# Altium project fMUX_MB.PrjPCB (part 2 of 6)

## Sheet Banks_7_8.SchDoc: FPGA Motherboard for Digital Multiplexed Readout, McGill U.
size B; DocumentNumber: DfMUX5; Revision: Rev0, Prototype; SheetNumber: 5; SheetTotal: 27; PageSetup: Record=PageOptions|CenterHorizontal=True|CenterVertical=True|PrintScale=1.08|XCorrection=1.00|YCorrection=1.00|PrintKind=0|BorderSize=5000000|LeftOffset=0|BottomOffset=0|Orientation=2|PaperLength=1000|PaperWidth=1000|Scale=100|PaperSource=7|PrintQuality=-4|MediaType=1|DitherType=10|PaperKind=Tabloid|PrintScaleMode=1
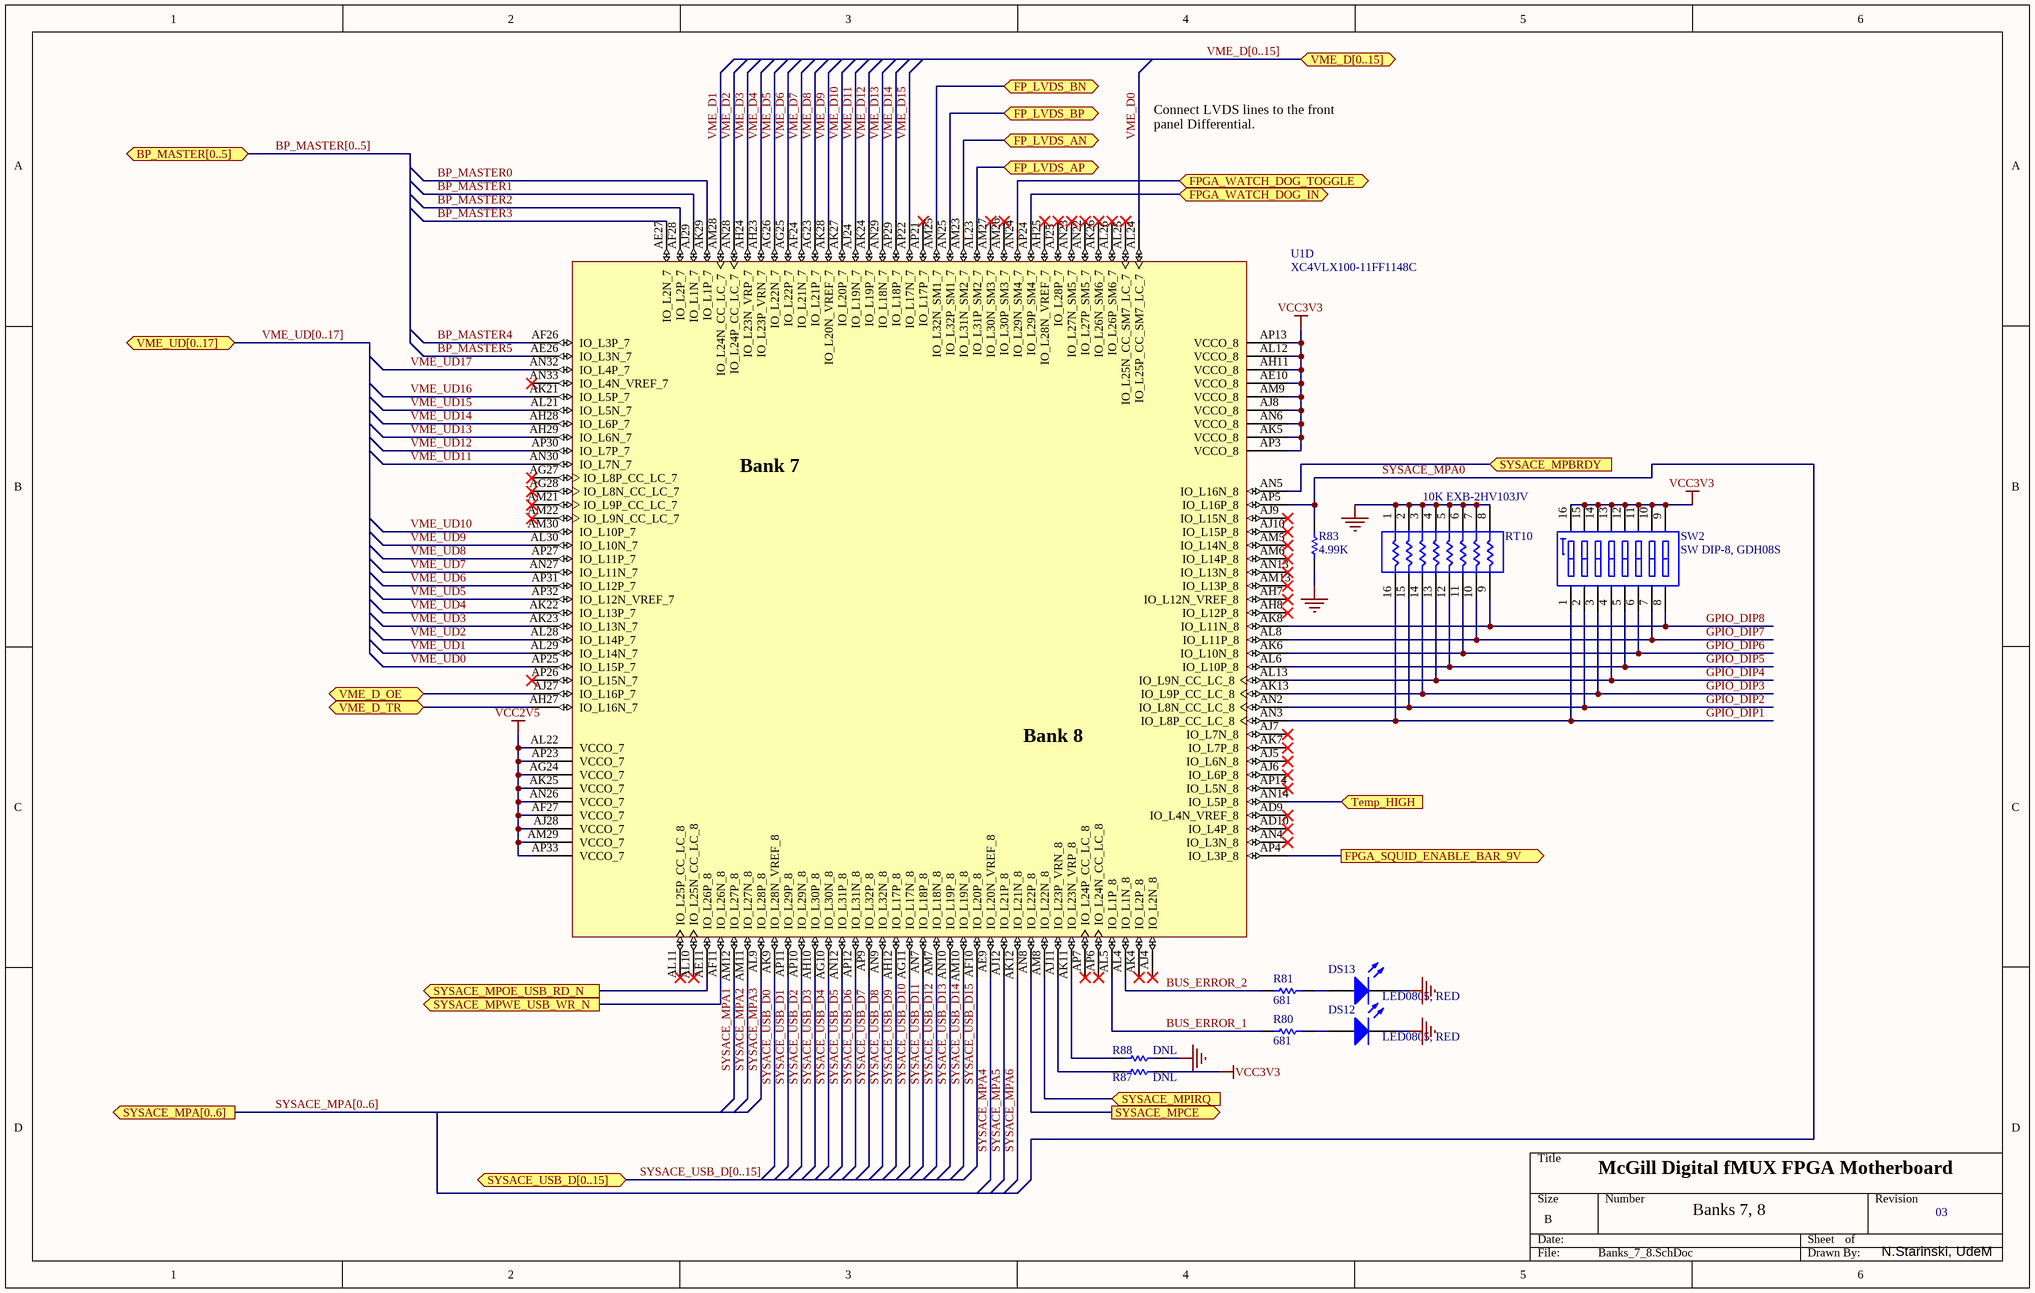
[diagram p4: Banks_7_8.SchDoc]

### Parts
DS12  LED0805, RED  [SMD _LED]
DS13  LED0805, RED  [SMD _LED]
R80  681  [CR1608-0603]
R81  681  [CR1608-0603]
R83  4.99K  [CR1608-0603]
R87  DNL  [CR1608-0603]
R88  DNL  [CR1608-0603]
RT10  10K EXB-2HV103JV  [0402_Array_2HV]
SW2  SW DIP-8, GDH08S  [DIP_SW_8WAY_SMD]
U1  XC4VLX100-11FF1148C  [FF1148]  (part D of 10)

### Ports
BP_MASTER[0..5], FP_LVDS_AN (bidir), FP_LVDS_AP (bidir), FP_LVDS_BN (bidir), FP_LVDS_BP (bidir), FPGA_SQUID_ENABLE_BAR_9V (out), FPGA_WATCH_DOG_IN (bidir), FPGA_WATCH_DOG_TOGGLE (bidir), SYSACE_MPA[0..6] (out), SYSACE_MPBRDY (in), SYSACE_MPCE (out), SYSACE_MPIRQ (in), SYSACE_MPOE_USB_RD_N (out), SYSACE_MPWE_USB_WR_N (out), SYSACE_USB_D[0..15], Temp_HIGH (in), VME_D[0..15] (bidir), VME_D_OE (bidir), VME_D_TR (bidir), VME_UD[0..17] (bidir)

### Nets
GND: DS12.2(K) DS13.2(K) R83.1 R88.2 RT10.1 RT10.2 RT10.3 RT10.4 RT10.5 RT10.6 RT10.7 RT10.8
VCC2V5: U1.AF27(VCCO_7) U1.AG24(VCCO_7) U1.AJ28(VCCO_7) U1.AK25(VCCO_7) U1.AL22(VCCO_7) U1.AM29(VCCO_7) U1.AN26(VCCO_7) U1.AP23(VCCO_7) U1.AP33(VCCO_7)  [project net Vout2]
VCC3V3: R87.2 SW2.9(B8) SW2.10(B7) SW2.11(B6) SW2.12(B5) SW2.13(B4) SW2.14(B3) SW2.15(B2) SW2.16(B1) U1.AE10(VCCO_8) U1.AH11(VCCO_8) U1.AJ8(VCCO_8) U1.AK5(VCCO_8) U1.AL12(VCCO_8) U1.AM9(VCCO_8) U1.AN6(VCCO_8) U1.AP3(VCCO_8) U1.AP13(VCCO_8)
BP_MASTER0: U1.AK29(IO_L1P_7)
BP_MASTER1: U1.AJ29(IO_L1N_7)
BP_MASTER2: U1.AF28(IO_L2P_7)
BP_MASTER3: U1.AE27(IO_L2N_7)
BP_MASTER4: U1.AF26(IO_L3P_7)
BP_MASTER5: U1.AE26(IO_L3N_7)
BUS_ERROR_1: R80.1 U1.AL5(IO_L1P_8)  [project net BUS_ERROR_1_5]
BUS_ERROR_2: R81.1 U1.AL4(IO_L1N_8)  [project net BUS_ERROR_2_5]
FDI: U1.AP24(IO_L29P_SM4_7) ; port FPGA_WATCH_DOG_IN
FDT: U1.AN24(IO_L29N_SM4_7) ; port FPGA_WATCH_DOG_TOGGLE
FP_LVDS_AN: U1.AM23(IO_L31N_SM2_7) ; port FP_LVDS_AN
FP_LVDS_AP: U1.AL23(IO_L31P_SM2_7) ; port FP_LVDS_AP
FP_LVDS_BN: U1.AM25(IO_L32N_SM1_7) ; port FP_LVDS_BN
FP_LVDS_BP: U1.AN25(IO_L32P_SM1_7) ; port FP_LVDS_BP
GPIO_DIP1: RT10.16 SW2.1(A1) U1.AN3(IO_L8P_CC_LC_8)  [project net GPIO_DIP1_5]
GPIO_DIP2: RT10.15 SW2.2(A2) U1.AN2(IO_L8N_CC_LC_8)  [project net GPIO_DIP2_5]
GPIO_DIP3: RT10.14 SW2.3(A3) U1.AK13(IO_L9P_CC_LC_8)  [project net GPIO_DIP3_5]
GPIO_DIP4: RT10.13 SW2.4(A4) U1.AL13(IO_L9N_CC_LC_8)  [project net GPIO_DIP4_5]
GPIO_DIP5: RT10.12 SW2.5(A5) U1.AL6(IO_L10P_8)  [project net GPIO_DIP5_5]
GPIO_DIP6: RT10.11 SW2.6(A6) U1.AK6(IO_L10N_8)  [project net GPIO_DIP6_5]
GPIO_DIP7: RT10.10 SW2.7(A7) U1.AL8(IO_L11P_8)  [project net GPIO_DIP7_5]
GPIO_DIP8: RT10.9 SW2.8(A8) U1.AK8(IO_L11N_8)  [project net GPIO_DIP8_5]
SQUID9V_EN: U1.AP4(IO_L3P_8) ; port FPGA_SQUID_ENABLE_BAR_9V
SYSACE_MPA0: R83.2 U1.AP5(IO_L16P_8)
SYSACE_MPA1: U1.AM12(IO_L27P_8)
SYSACE_MPA2: U1.AM11(IO_L27N_8)
SYSACE_MPA3: U1.AL9(IO_L28P_8)
SYSACE_MPA4: U1.AE9(IO_L20N_VREF_8)
SYSACE_MPA5: U1.AJ12(IO_L21P_8)
SYSACE_MPA6: U1.AK12(IO_L21N_8)
SYSACE_MPBRDY: U1.AN5(IO_L16N_8) ; port SYSACE_MPBRDY
SYSACE_MPCE: U1.AN8(IO_L22P_8) ; port SYSACE_MPCE
SYSACE_MPIRQ: U1.AM8(IO_L22N_8) ; port SYSACE_MPIRQ
SYSACE_MPOE_USB_RD_N: U1.AE11(IO_L26P_8) ; port SYSACE_MPOE_USB_RD_N
SYSACE_MPWE_USB_WR_N: U1.AF11(IO_L26N_8) ; port SYSACE_MPWE_USB_WR_N
SYSACE_USB_D0: U1.AK9(IO_L28N_VREF_8)
SYSACE_USB_D1: U1.AP11(IO_L29P_8)
SYSACE_USB_D2: U1.AP10(IO_L29N_8)
SYSACE_USB_D3: U1.AH10(IO_L30P_8)
SYSACE_USB_D4: U1.AG10(IO_L30N_8)
SYSACE_USB_D5: U1.AN12(IO_L31P_8)
SYSACE_USB_D6: U1.AP12(IO_L31N_8)
SYSACE_USB_D7: U1.AP9(IO_L32P_8)
SYSACE_USB_D8: U1.AN9(IO_L32N_8)
SYSACE_USB_D9: U1.AH12(IO_L17P_8)
SYSACE_USB_D10: U1.AG11(IO_L17N_8)
SYSACE_USB_D11: U1.AN7(IO_L18P_8)
SYSACE_USB_D12: U1.AM7(IO_L18N_8)
SYSACE_USB_D13: U1.AN10(IO_L19P_8)
SYSACE_USB_D14: U1.AM10(IO_L19N_8)
SYSACE_USB_D15: U1.AF10(IO_L20P_8)
Temp_HIGH: U1.AN14(IO_L5P_8) ; port Temp_HIGH
VME_D0: U1.AL24(IO_L25P_CC_SM7_LC_7)
VME_D1: U1.AM28(IO_L24N_CC_LC_7)
VME_D2: U1.AN28(IO_L24P_CC_LC_7)
VME_D3: U1.AH24(IO_L23N_VRP_7)
VME_D4: U1.AH23(IO_L23P_VRN_7)
VME_D5: U1.AG26(IO_L22N_7)
VME_D6: U1.AG25(IO_L22P_7)
VME_D7: U1.AF24(IO_L21N_7)
VME_D8: U1.AG23(IO_L21P_7)
VME_D9: U1.AK28(IO_L20N_VREF_7)
VME_D10: U1.AK27(IO_L20P_7)
VME_D11: U1.AJ24(IO_L19N_7)
VME_D12: U1.AK24(IO_L19P_7)
VME_D13: U1.AN29(IO_L18N_7)
VME_D14: U1.AP29(IO_L18P_7)
VME_D15: U1.AP22(IO_L17N_7)
VME_D_OE: U1.AJ27(IO_L16P_7) ; port VME_D_OE
VME_D_TR: U1.AH27(IO_L16N_7) ; port VME_D_TR
VME_UD0: U1.AP25(IO_L15P_7)
VME_UD1: U1.AL29(IO_L14N_7)
VME_UD2: U1.AL28(IO_L14P_7)
VME_UD3: U1.AK23(IO_L13N_7)
VME_UD4: U1.AK22(IO_L13P_7)
VME_UD5: U1.AP32(IO_L12N_VREF_7)
VME_UD6: U1.AP31(IO_L12P_7)
VME_UD7: U1.AN27(IO_L11N_7)
VME_UD8: U1.AP27(IO_L11P_7)
VME_UD9: U1.AL30(IO_L10N_7)
VME_UD10: U1.AM30(IO_L10P_7)
VME_UD11: U1.AN30(IO_L7N_7)
VME_UD12: U1.AP30(IO_L7P_7)
VME_UD13: U1.AH29(IO_L6N_7)
VME_UD14: U1.AH28(IO_L6P_7)
VME_UD15: U1.AL21(IO_L5N_7)
VME_UD16: U1.AK21(IO_L5P_7)
VME_UD17: U1.AN32(IO_L4P_7)
NetDS12_1: DS12.1(A) R80.2
NetDS13_1: DS13.1(A) R81.2
NetR87_1: R87.1 U1.AJ11(IO_L23P_VRN_8)
NetR88_1: R88.1 U1.AK11(IO_L23N_VRP_8)

Not connected (* = marked no-connect by the designer): U1 AD9(IO_L4N_VREF_8)* AD10(IO_L4P_8)* AG27(IO_L8P_CC_LC_7)* AG28(IO_L8N_CC_LC_7)* AH7(IO_L12N_VREF_8)* AH8(IO_L12P_8)* AH25(IO_L28N_VREF_7)* AJ4(IO_L2N_8)* AJ5(IO_L6N_8)* AJ6(IO_L6P_8)* AJ7(IO_L7N_8)* AJ9(IO_L15N_8)* AJ10(IO_L15P_8)* AJ25(IO_L28P_7)* AK4(IO_L2P_8)* AK7(IO_L7P_8)* AK26(IO_L26N_SM6_7)* AL10(IO_L25N_CC_LC_8)* AL11(IO_L25P_CC_LC_8)* AL25(IO_L25N_CC_SM7_LC_7)* AL26(IO_L26P_SM6_7)* AM5(IO_L14N_8)* AM6(IO_L14P_8)* AM13(IO_L13P_8)* AM21(IO_L9P_CC_LC_7)* AM22(IO_L9N_CC_LC_7)* AM26(IO_L30P_SM3_7)* AM27(IO_L30N_SM3_7)* AN4(IO_L3N_8)* AN13(IO_L13N_8)* AN22(IO_L27P_SM5_7)* AN23(IO_L27N_SM5_7)* AN33(IO_L4N_VREF_7)* AP6(IO_L24N_CC_LC_8)* AP7(IO_L24P_CC_LC_8)* AP14(IO_L5N_8)* AP21(IO_L17P_7)* AP26(IO_L15N_7)*

### Buses and harness runs
bus BP_MASTER[0..5] = port BP_MASTER[0..5]
bus SYSACE_MPA[0..6] = port SYSACE_MPA[0..6]
bus SYSACE_USB_D[0..15] = port SYSACE_USB_D[0..15]
bus VME_D[0..15] = port VME_D[0..15]
bus VME_UD[0..17] = port VME_UD[0..17]

### Notes on the sheet
- Connect LVDS lines to the front panel Differential.
- McGill Digital fMUX FPGA Motherboard
- Banks 7, 8
- 03
- N.Starinski, UdeM
- (in symbol XC4VLX100-11FF1148C, part D) Bank 7; Bank 8

### Library data of the parts
DS12 DS13 = LED3: LED 0805 LTST-C170CKT; Published: 8-Jun-2000; LatestRevisionDate: 17-Dec-2003; LatestRevisionNote: PCB Footprint replaced.; Publisher: Altium Limited
R80 R81 R83 = Res Semi: Resistor 0603; Published: 8-Jun-2000; LatestRevisionDate: 17-Jul-2002; LatestRevisionNote: Re-released for DXP Platform.; Publisher: Altium Limited
R87 R88 = Res Semi: Semiconductor Resistor; Published: 8-Jun-2000; LatestRevisionDate: 17-Jul-2002; LatestRevisionNote: Re-released for DXP Platform.; Publisher: Altium Limited
RT10 = Res Pack3: Isolated Resistor Network; Published: 24-Mar-1999; LatestRevisionDate: 17-Jul-2002; LatestRevisionNote: Re-released for DXP Platform.; Publisher: Altium Limited
SW2 = SW DIP-8: DIP Switch, 8 Position, SPST; Published: 24-Mar-1999; LatestRevisionDate: 17-Jul-2002; LatestRevisionNote: Re-released for DXP Platform.; Publisher: Altium Limited
U1 = XC4VLX100-11FF1148C: Xilinx Virtex-4 LX Platform FPGA, 1148-Ball FFBGA, Speed Grade 11, 768 User I/Os, Commercial Grade; PackageDocument: ver1.0, Oct-2002; Published: 13-Dec-2004; LatestRevisionDate: 4-Mar-2005; LatestRevisionNote: D_IN & CS_B pins changed from I/O to Input. DOUT_BUSY pin changed from I/O to Output.; DatasheetDocument: ver1.2, Dec-2004; PackageReference: FF1148; Publisher: Altium Limited; ComponentLink2Description: Virtex-4 Overview; ComponentLink2URL: http://www.xilinx.com/products/virtex4/overview.htm; ComponentLink3Description: Datasheet; ComponentLink3URL: http://direct.xilinx.com/bvdocs/userguides/ug075.pdf; Code_JEDEC: MS-034-AAR-1

## Sheet Banks_9_10.SchDoc: FPGA Motherboard for Digital Multiplexed Readout, McGill U.
size B; DocumentNumber: DfMUX6; Revision: Rev0, Prototype; SheetNumber: 6; SheetTotal: 27; PageSetup: Record=PageOptions|CenterHorizontal=True|CenterVertical=True|PrintScale=1.08|XCorrection=1.00|YCorrection=1.00|PrintKind=0|BorderSize=5000000|LeftOffset=0|BottomOffset=0|Orientation=2|PaperLength=1000|PaperWidth=1000|Scale=100|PaperSource=7|PrintQuality=-4|MediaType=1|DitherType=10|PaperKind=Tabloid|PrintScaleMode=1
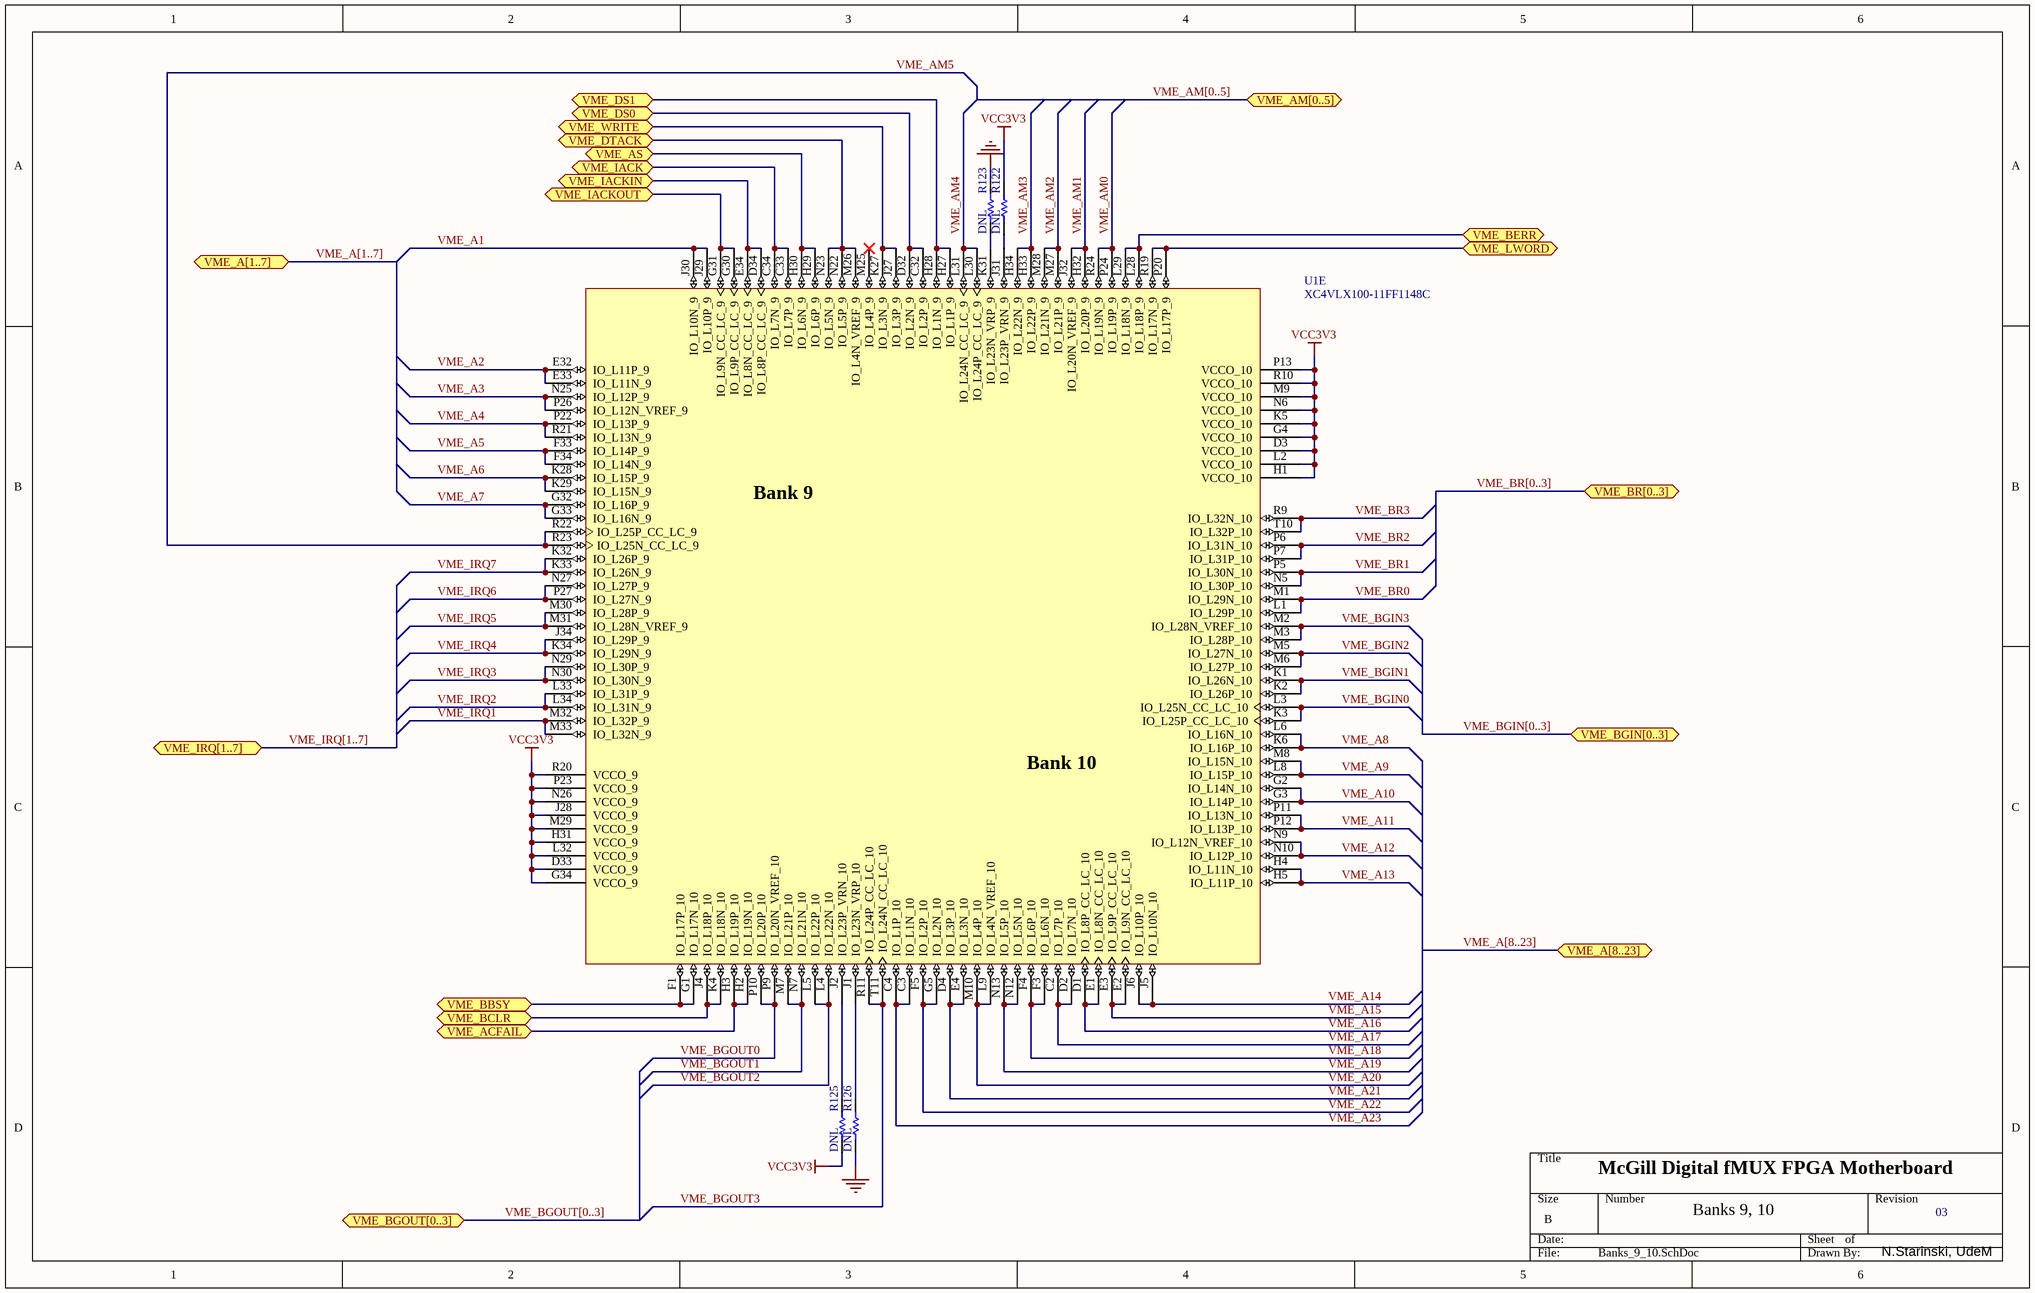
[diagram p5: Banks_9_10.SchDoc]

### Parts
R122  DNL  [CR1608-0603]
R123  DNL  [CR1608-0603]
R125  DNL  [CR1608-0603]
R126  DNL  [CR1608-0603]
U1  XC4VLX100-11FF1148C  [FF1148]  (part E of 10)

### Ports
VME_A[1..7] (bidir), VME_A[8..23] (bidir), VME_ACFAIL (bidir), VME_AM[0..5] (bidir), VME_AS (bidir), VME_BBSY (bidir), VME_BCLR (bidir), VME_BERR (bidir), VME_BGIN[0..3] (bidir), VME_BGOUT[0..3] (bidir), VME_BR[0..3] (bidir), VME_DS0 (bidir), VME_DS1 (bidir), VME_DTACK (bidir), VME_IACK (bidir), VME_IACKIN (bidir), VME_IACKOUT (bidir), VME_IRQ[1..7] (bidir), VME_LWORD (bidir), VME_WRITE (bidir)

### Nets
GND: R123.2 R126.1
VCC3V3: R122.2 R125.1 U1.D3(VCCO_10) U1.D33(VCCO_9) U1.G4(VCCO_10) U1.G34(VCCO_9) U1.H1(VCCO_10) U1.H31(VCCO_9) U1.J28(VCCO_9) U1.K5(VCCO_10) U1.L2(VCCO_10) U1.L32(VCCO_9) U1.M9(VCCO_10) U1.M29(VCCO_9) U1.N6(VCCO_10) U1.N26(VCCO_9) U1.P13(VCCO_10) U1.P23(VCCO_9) U1.R10(VCCO_10) U1.R20(VCCO_9)
VME_A1: U1.J29(IO_L10P_9) U1.J30(IO_L10N_9)
VME_A2: U1.E32(IO_L11P_9) U1.E33(IO_L11N_9)
VME_A3: U1.N25(IO_L12P_9) U1.P26(IO_L12N_VREF_9)
VME_A4: U1.P22(IO_L13P_9) U1.R21(IO_L13N_9)
VME_A5: U1.F33(IO_L14P_9) U1.F34(IO_L14N_9)
VME_A6: U1.K28(IO_L15P_9) U1.K29(IO_L15N_9)
VME_A7: U1.G32(IO_L16P_9) U1.G33(IO_L16N_9)
VME_A8: U1.K6(IO_L16P_10) U1.L6(IO_L16N_10)
VME_A9: U1.L8(IO_L15P_10) U1.M8(IO_L15N_10)
VME_A10: U1.G2(IO_L14N_10) U1.G3(IO_L14P_10)
VME_A11: U1.P11(IO_L13N_10) U1.P12(IO_L13P_10)
VME_A12: U1.N9(IO_L12N_VREF_10) U1.N10(IO_L12P_10)
VME_A13: U1.H4(IO_L11N_10) U1.H5(IO_L11P_10)
VME_A14: U1.J5(IO_L10N_10) U1.J6(IO_L10P_10)
VME_A15: U1.E2(IO_L9N_CC_LC_10) U1.E3(IO_L9P_CC_LC_10)
VME_A16: U1.D1(IO_L8P_CC_LC_10) U1.E1(IO_L8N_CC_LC_10)
VME_A17: U1.C2(IO_L7P_10) U1.D2(IO_L7N_10)
VME_A18: U1.F3(IO_L6N_10) U1.F4(IO_L6P_10)
VME_A19: U1.N12(IO_L5N_10) U1.N13(IO_L5P_10)
VME_A20: U1.L9(IO_L4N_VREF_10) U1.M10(IO_L4P_10)
VME_A21: U1.D4(IO_L3P_10) U1.E4(IO_L3N_10)
VME_A22: U1.F5(IO_L2P_10) U1.G5(IO_L2N_10)
VME_A23: U1.C3(IO_L1N_10) U1.C4(IO_L1P_10)
VME_ACFAIL: U1.H2(IO_L19N_10) U1.H3(IO_L19P_10) ; port VME_ACFAIL
VME_AM0: U1.P24(IO_L19P_9) U1.R24(IO_L19N_9)
VME_AM1: U1.H32(IO_L20P_9) U1.J32(IO_L20N_VREF_9)
VME_AM2: U1.M27(IO_L21P_9) U1.M28(IO_L21N_9)
VME_AM3: U1.H33(IO_L22P_9) U1.H34(IO_L22N_9)
VME_AM4: U1.L30(IO_L24P_CC_LC_9) U1.L31(IO_L24N_CC_LC_9)
VME_AM5: U1.R22(IO_L25P_CC_LC_9) U1.R23(IO_L25N_CC_LC_9)
VME_AS: U1.H29(IO_L6P_9) U1.H30(IO_L6N_9) ; port VME_AS
VME_BBSY: U1.F1(IO_L17P_10) U1.G1(IO_L17N_10) ; port VME_BBSY
VME_BCLR: U1.J4(IO_L18P_10) U1.K4(IO_L18N_10) ; port VME_BCLR
VME_BERR: U1.L28(IO_L18P_9) U1.L29(IO_L18N_9) ; port VME_BERR
VME_BGIN0: U1.K3(IO_L25P_CC_LC_10) U1.L3(IO_L25N_CC_LC_10)
VME_BGIN1: U1.K1(IO_L26N_10) U1.K2(IO_L26P_10)
VME_BGIN2: U1.M5(IO_L27N_10) U1.M6(IO_L27P_10)
VME_BGIN3: U1.M2(IO_L28N_VREF_10) U1.M3(IO_L28P_10)
VME_BGOUT0: U1.P9(IO_L20N_VREF_10) U1.P10(IO_L20P_10)
VME_BGOUT1: U1.M7(IO_L21P_10) U1.N7(IO_L21N_10)
VME_BGOUT2: U1.L4(IO_L22N_10) U1.L5(IO_L22P_10)
VME_BGOUT3: U1.R11(IO_L24P_CC_LC_10) U1.T11(IO_L24N_CC_LC_10)
VME_BR0: U1.L1(IO_L29P_10) U1.M1(IO_L29N_10)
VME_BR1: U1.N5(IO_L30P_10) U1.P5(IO_L30N_10)
VME_BR2: U1.P6(IO_L31N_10) U1.P7(IO_L31P_10)
VME_BR3: U1.R9(IO_L32N_10) U1.T10(IO_L32P_10)
VME_DS0: U1.C32(IO_L2P_9) U1.D32(IO_L2N_9) ; port VME_DS0
VME_DS1: U1.H27(IO_L1P_9) U1.H28(IO_L1N_9) ; port VME_DS1
VME_DTACK: U1.M26(IO_L4N_VREF_9) U1.N22(IO_L5P_9) U1.N23(IO_L5N_9) ; port VME_DTACK
VME_IACK: U1.C33(IO_L7P_9) U1.C34(IO_L7N_9) ; port VME_IACK
VME_IACKIN: U1.D34(IO_L8P_CC_LC_9) U1.E34(IO_L8N_CC_LC_9) ; port VME_IACKIN
VME_IACKOUT: U1.G30(IO_L9P_CC_LC_9) U1.G31(IO_L9N_CC_LC_9) ; port VME_IACKOUT
VME_IRQ1: U1.M32(IO_L32P_9) U1.M33(IO_L32N_9)
VME_IRQ2: U1.L33(IO_L31P_9) U1.L34(IO_L31N_9)
VME_IRQ3: U1.N29(IO_L30P_9) U1.N30(IO_L30N_9)
VME_IRQ4: U1.J34(IO_L29P_9) U1.K34(IO_L29N_9)
VME_IRQ5: U1.M30(IO_L28P_9) U1.M31(IO_L28N_VREF_9)
VME_IRQ6: U1.N27(IO_L27P_9) U1.P27(IO_L27N_9)
VME_IRQ7: U1.K32(IO_L26P_9) U1.K33(IO_L26N_9)
VME_LWORD: U1.P20(IO_L17P_9) U1.R19(IO_L17N_9) ; port VME_LWORD
VME_WRITE: U1.J27(IO_L3P_9) U1.K27(IO_L3N_9) ; port VME_WRITE
NetR122_1: R122.1 U1.J31(IO_L23P_VRN_9)
NetR123_1: R123.1 U1.K31(IO_L23N_VRP_9)
NetR125_2: R125.2 U1.J2(IO_L23P_VRN_10)
NetR126_2: R126.2 U1.J1(IO_L23N_VRP_10)

Not connected (* = marked no-connect by the designer): U1 M25(IO_L4P_9)*

### Buses and harness runs
bus VME_A[1..7] = port VME_A[1..7]
bus VME_A[8..23] = port VME_A[8..23]
bus VME_AM[0..5] = port VME_AM[0..5]
bus VME_BGIN[0..3] = port VME_BGIN[0..3]
bus VME_BGOUT[0..3] = port VME_BGOUT[0..3]
bus VME_BR[0..3] = port VME_BR[0..3]
bus VME_IRQ[1..7] = port VME_IRQ[1..7]

### Notes on the sheet
- McGill Digital fMUX FPGA Motherboard
- Banks 9, 10
- 03
- N.Starinski, UdeM
- (in symbol XC4VLX100-11FF1148C, part E) Bank 9; Bank 10

### Library data of the parts
R122 R123 R125 R126 = Res Semi: Semiconductor Resistor; Published: 8-Jun-2000; LatestRevisionDate: 17-Jul-2002; LatestRevisionNote: Re-released for DXP Platform.; Publisher: Altium Limited
U1 = XC4VLX100-11FF1148C: as U1 on sheet Banks_7_8; Published: 13-Dec-2004; LatestRevisionDate: 4-Mar-2005; LatestRevisionNote: D_IN & CS_B pins changed from I/O to Input. DOUT_BUSY pin changed from I/O to Output.; DatasheetDocument: ver1.2, Dec-2004; PackageReference: FF1148; Publisher: Altium Limited; ComponentLink2Description: Virtex-4 Overview; ComponentLink2URL: http://www.xilinx.com/products/virtex4/overview.htm; ComponentLink3Description: Datasheet; ComponentLink3URL: http://direct.xilinx.com/bvdocs/userguides/ug075.pdf; Code_JEDEC: MS-034-AAR-1

## Sheet Banks_11_12.SchDoc: FPGA Motherboard for Digital Multiplexed Readout, McGill U.
size Tabloid; DocumentNumber: DfMUX7; Revision: Rev0, Prototype; SheetNumber: 7; SheetTotal: 27; PageSetup: Record=PageOptions|CenterHorizontal=True|CenterVertical=True|PrintScale=0.95|XCorrection=1.00|YCorrection=1.00|PrintKind=0|BorderSize=5000000|LeftOffset=0|BottomOffset=0|Orientation=2|PaperLength=1000|PaperWidth=1000|Scale=100|PaperSource=7|PrintQuality=-4|MediaType=1|DitherType=10|PaperKind=Tabloid|PrintScaleMode=1
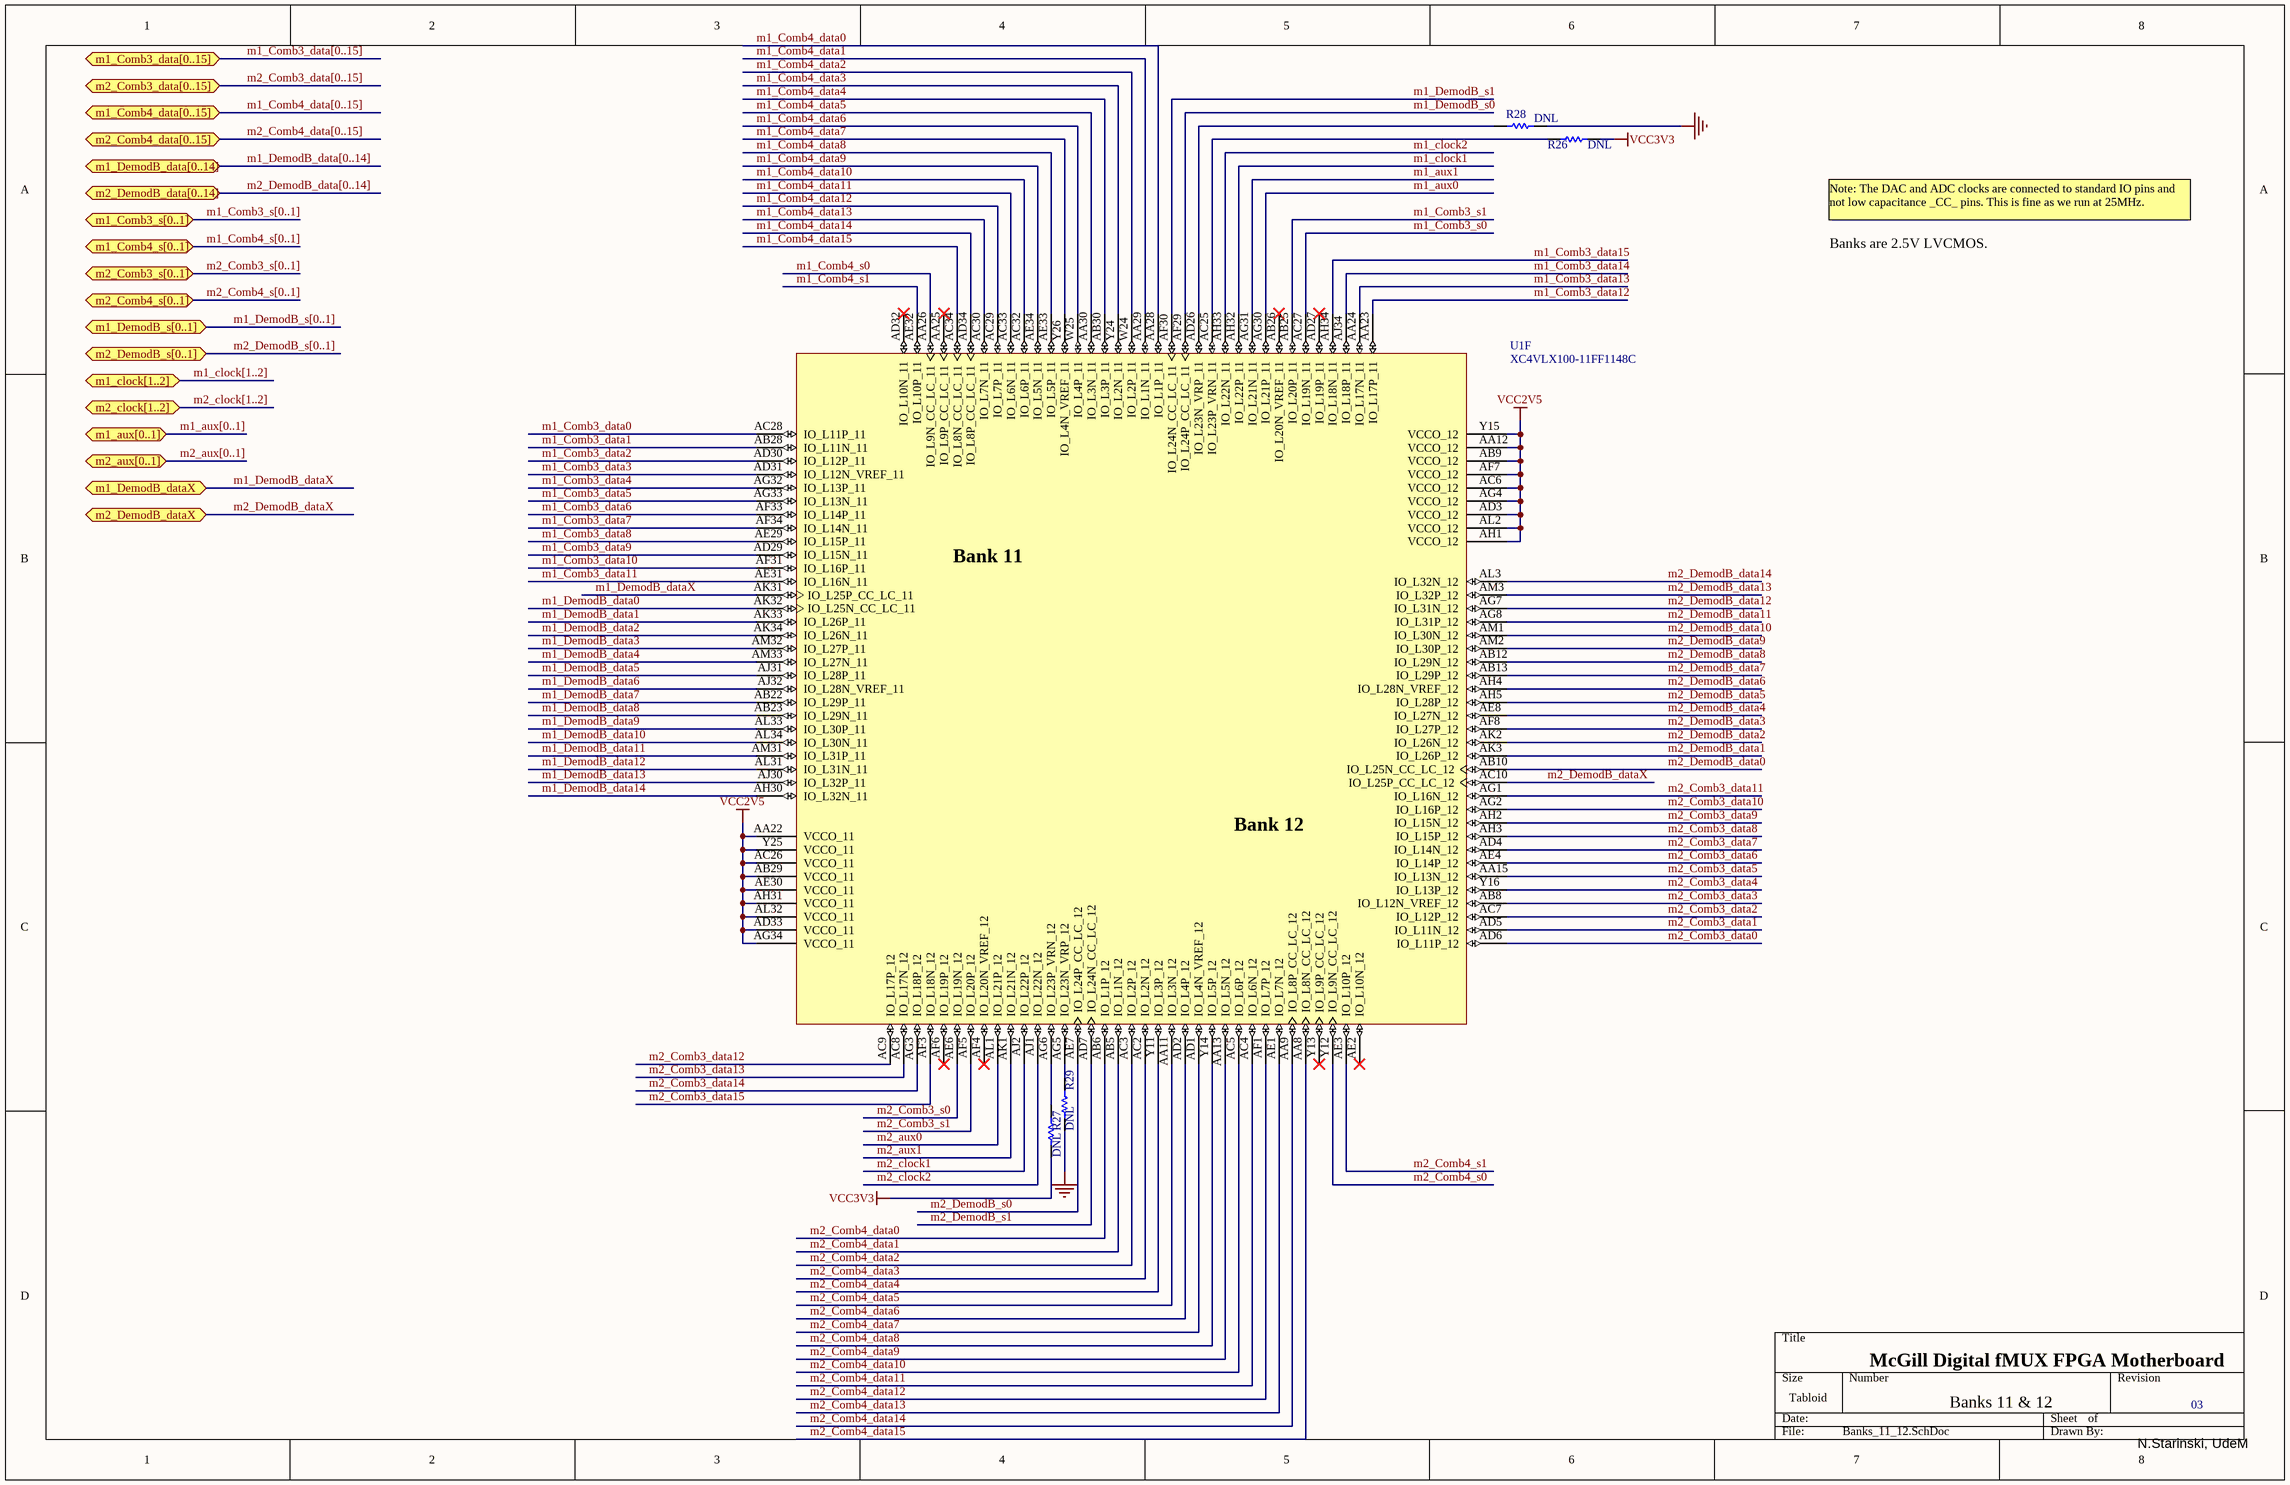
[diagram p6: Banks_11_12.SchDoc]

### Parts
R26  DNL  [CR1608-0603]
R27  DNL  [CR1608-0603]
R28  DNL  [CR1608-0603]
R29  DNL  [CR1608-0603]
U1  XC4VLX100-11FF1148C  [FF1148]  (part F of 10)

### Ports
m1_aux[0..1] (bidir), m1_clock[1..2] (bidir), m1_Comb3_data[0..15] (bidir), m1_Comb3_s[0..1] (bidir), m1_Comb4_data[0..15] (bidir), m1_Comb4_s[0..1] (bidir), m1_DemodB_data[0..14] (bidir), m1_DemodB_dataX (bidir), m1_DemodB_s[0..1] (bidir), m2_aux[0..1] (bidir), m2_clock[1..2] (bidir), m2_Comb3_data[0..15] (bidir), m2_Comb3_s[0..1] (bidir), m2_Comb4_data[0..15] (bidir), m2_Comb4_s[0..1] (bidir), m2_DemodB_data[0..14] (bidir), m2_DemodB_dataX (bidir), m2_DemodB_s[0..1] (bidir)

### Nets
GND: R28.2 R29.1
VCC2V5: U1.AA12(VCCO_12) U1.AA22(VCCO_11) U1.AB9(VCCO_12) U1.AB29(VCCO_11) U1.AC6(VCCO_12) U1.AC26(VCCO_11) U1.AD3(VCCO_12) U1.AD33(VCCO_11) U1.AE30(VCCO_11) U1.AF7(VCCO_12) U1.AG4(VCCO_12) U1.AG34(VCCO_11) U1.AH1(VCCO_12) U1.AH31(VCCO_11) U1.AL2(VCCO_12) U1.AL32(VCCO_11) U1.Y15(VCCO_12) U1.Y25(VCCO_11)  [project net Vout2]
VCC3V3: R26.2 R27.1
m1_aux0: U1.AG30(IO_L21P_11)
m1_aux1: U1.AG31(IO_L21N_11)
m1_clock1: U1.AH32(IO_L22P_11)
m1_clock2: U1.AH33(IO_L22N_11)
m1_Comb3_data0: U1.AC28(IO_L11P_11)
m1_Comb3_data1: U1.AB28(IO_L11N_11)
m1_Comb3_data2: U1.AD30(IO_L12P_11)
m1_Comb3_data3: U1.AD31(IO_L12N_VREF_11)
m1_Comb3_data4: U1.AG32(IO_L13P_11)
m1_Comb3_data5: U1.AG33(IO_L13N_11)
m1_Comb3_data6: U1.AF33(IO_L14P_11)
m1_Comb3_data7: U1.AF34(IO_L14N_11)
m1_Comb3_data8: U1.AE29(IO_L15P_11)
m1_Comb3_data9: U1.AD29(IO_L15N_11)
m1_Comb3_data10: U1.AF31(IO_L16P_11)
m1_Comb3_data11: U1.AE31(IO_L16N_11)
m1_Comb3_data12: U1.AA23(IO_L17P_11)
m1_Comb3_data13: U1.AA24(IO_L17N_11)
m1_Comb3_data14: U1.AJ34(IO_L18P_11)
m1_Comb3_data15: U1.AH34(IO_L18N_11)
m1_Comb3_s0: U1.AC27(IO_L19N_11)
m1_Comb3_s1: U1.AB25(IO_L20P_11)
m1_Comb4_data0: U1.AA28(IO_L1P_11)
m1_Comb4_data1: U1.AA29(IO_L1N_11)
m1_Comb4_data2: U1.W24(IO_L2P_11)
m1_Comb4_data3: U1.Y24(IO_L2N_11)
m1_Comb4_data4: U1.AB30(IO_L3P_11)
m1_Comb4_data5: U1.AA30(IO_L3N_11)
m1_Comb4_data6: U1.W25(IO_L4P_11)
m1_Comb4_data7: U1.Y26(IO_L4N_VREF_11)
m1_Comb4_data8: U1.AE33(IO_L5P_11)
m1_Comb4_data9: U1.AE34(IO_L5N_11)
m1_Comb4_data10: U1.AC32(IO_L6P_11)
m1_Comb4_data11: U1.AC33(IO_L6N_11)
m1_Comb4_data12: U1.AC29(IO_L7P_11)
m1_Comb4_data13: U1.AC30(IO_L7N_11)
m1_Comb4_data14: U1.AD34(IO_L8P_CC_LC_11)
m1_Comb4_data15: U1.AC34(IO_L8N_CC_LC_11)
m1_Comb4_s0: U1.AA26(IO_L9N_CC_LC_11)
m1_Comb4_s1: U1.AE32(IO_L10P_11)
m1_DemodB_data0: U1.AK32(IO_L25N_CC_LC_11)
m1_DemodB_data1: U1.AK33(IO_L26P_11)
m1_DemodB_data2: U1.AK34(IO_L26N_11)
m1_DemodB_data3: U1.AM32(IO_L27P_11)
m1_DemodB_data4: U1.AM33(IO_L27N_11)
m1_DemodB_data5: U1.AJ31(IO_L28P_11)
m1_DemodB_data6: U1.AJ32(IO_L28N_VREF_11)
m1_DemodB_data7: U1.AB22(IO_L29P_11)
m1_DemodB_data8: U1.AB23(IO_L29N_11)
m1_DemodB_data9: U1.AL33(IO_L30P_11)
m1_DemodB_data10: U1.AL34(IO_L30N_11)
m1_DemodB_data11: U1.AM31(IO_L31P_11)
m1_DemodB_data12: U1.AL31(IO_L31N_11)
m1_DemodB_data13: U1.AJ30(IO_L32P_11)
m1_DemodB_data14: U1.AH30(IO_L32N_11)
m1_DemodB_dataX: U1.AK31(IO_L25P_CC_LC_11) ; port m1_DemodB_dataX
m1_DemodB_s0: U1.AF29(IO_L24P_CC_LC_11)
m1_DemodB_s1: U1.AF30(IO_L24N_CC_LC_11)
m2_aux0: U1.AL1(IO_L21P_12)
m2_aux1: U1.AK1(IO_L21N_12)
m2_clock1: U1.AJ2(IO_L22P_12)
m2_clock2: U1.AJ1(IO_L22N_12)
m2_Comb3_data0: U1.AD6(IO_L11P_12)
m2_Comb3_data1: U1.AD5(IO_L11N_12)
m2_Comb3_data2: U1.AC7(IO_L12P_12)
m2_Comb3_data3: U1.AB8(IO_L12N_VREF_12)
m2_Comb3_data4: U1.Y16(IO_L13P_12)
m2_Comb3_data5: U1.AA15(IO_L13N_12)
m2_Comb3_data6: U1.AE4(IO_L14P_12)
m2_Comb3_data7: U1.AD4(IO_L14N_12)
m2_Comb3_data8: U1.AH3(IO_L15P_12)
m2_Comb3_data9: U1.AH2(IO_L15N_12)
m2_Comb3_data10: U1.AG2(IO_L16P_12)
m2_Comb3_data11: U1.AG1(IO_L16N_12)
m2_Comb3_data12: U1.AC9(IO_L17P_12)
m2_Comb3_data13: U1.AC8(IO_L17N_12)
m2_Comb3_data14: U1.AG3(IO_L18P_12)
m2_Comb3_data15: U1.AF3(IO_L18N_12)
m2_Comb3_s0: U1.AE6(IO_L19N_12)
m2_Comb3_s1: U1.AF5(IO_L20P_12)
m2_Comb4_data0: U1.AB6(IO_L1P_12)
m2_Comb4_data1: U1.AB5(IO_L1N_12)
m2_Comb4_data2: U1.AC3(IO_L2P_12)
m2_Comb4_data3: U1.AC2(IO_L2N_12)
m2_Comb4_data4: U1.Y11(IO_L3P_12)
m2_Comb4_data5: U1.AA11(IO_L3N_12)
m2_Comb4_data6: U1.AD2(IO_L4P_12)
m2_Comb4_data7: U1.AD1(IO_L4N_VREF_12)
m2_Comb4_data8: U1.Y14(IO_L5P_12)
m2_Comb4_data9: U1.AA13(IO_L5N_12)
m2_Comb4_data10: U1.AC5(IO_L6P_12)
m2_Comb4_data11: U1.AC4(IO_L6N_12)
m2_Comb4_data12: U1.AF1(IO_L7P_12)
m2_Comb4_data13: U1.AE1(IO_L7N_12)
m2_Comb4_data14: U1.AA9(IO_L8P_CC_LC_12)
m2_Comb4_data15: U1.AA8(IO_L8N_CC_LC_12)
m2_Comb4_s0: U1.Y12(IO_L9N_CC_LC_12)
m2_Comb4_s1: U1.AE3(IO_L10P_12)
m2_DemodB_data0: U1.AB10(IO_L25N_CC_LC_12)
m2_DemodB_data1: U1.AK3(IO_L26P_12)
m2_DemodB_data2: U1.AK2(IO_L26N_12)
m2_DemodB_data3: U1.AF8(IO_L27P_12)
m2_DemodB_data4: U1.AE8(IO_L27N_12)
m2_DemodB_data5: U1.AH5(IO_L28P_12)
m2_DemodB_data6: U1.AH4(IO_L28N_VREF_12)
m2_DemodB_data7: U1.AB13(IO_L29P_12)
m2_DemodB_data8: U1.AB12(IO_L29N_12)
m2_DemodB_data9: U1.AM2(IO_L30P_12)
m2_DemodB_data10: U1.AM1(IO_L30N_12)
m2_DemodB_data11: U1.AG8(IO_L31P_12)
m2_DemodB_data12: U1.AG7(IO_L31N_12)
m2_DemodB_data13: U1.AM3(IO_L32P_12)
m2_DemodB_data14: U1.AL3(IO_L32N_12)
m2_DemodB_dataX: U1.AC10(IO_L25P_CC_LC_12) ; port m2_DemodB_dataX
m2_DemodB_s0: U1.AE7(IO_L24P_CC_LC_12)
m2_DemodB_s1: U1.AD7(IO_L24N_CC_LC_12)
NetR26_1: R26.1 U1.AC25(IO_L23P_VRN_11)
NetR27_2: R27.2 U1.AG6(IO_L23P_VRN_12)
NetR28_1: R28.1 U1.AD26(IO_L23N_VRP_11)
NetR29_2: R29.2 U1.AG5(IO_L23N_VRP_12)

Not connected (* = marked no-connect by the designer): U1 AA25(IO_L9P_CC_LC_11)* AB26(IO_L20N_VREF_11)* AD27(IO_L19P_11)* AD32(IO_L10N_11)* AE2(IO_L10N_12)* AF4(IO_L20N_VREF_12)* AF6(IO_L19P_12)* Y13(IO_L9P_CC_LC_12)*

### Buses and harness runs
bus m1_aux[0..1] = port m1_aux[0..1]
bus m1_clock[1..2] = port m1_clock[1..2]
bus m1_Comb3_data[0..15] = port m1_Comb3_data[0..15]
bus m1_Comb3_s[0..1] = port m1_Comb3_s[0..1]
bus m1_Comb4_data[0..15] = port m1_Comb4_data[0..15]
bus m1_Comb4_s[0..1] = port m1_Comb4_s[0..1]
bus m1_DemodB_data[0..14] = port m1_DemodB_data[0..14]
bus m1_DemodB_s[0..1] = port m1_DemodB_s[0..1]
bus m2_aux[0..1] = port m2_aux[0..1]
bus m2_clock[1..2] = port m2_clock[1..2]
bus m2_Comb3_data[0..15] = port m2_Comb3_data[0..15]
bus m2_Comb3_s[0..1] = port m2_Comb3_s[0..1]
bus m2_Comb4_data[0..15] = port m2_Comb4_data[0..15]
bus m2_Comb4_s[0..1] = port m2_Comb4_s[0..1]
bus m2_DemodB_data[0..14] = port m2_DemodB_data[0..14]
bus m2_DemodB_s[0..1] = port m2_DemodB_s[0..1]

### Notes on the sheet
- Note: The DAC and ADC clocks are connected to standard IO pins and not low capacitance _CC_ pins. This is fine as we run at 25MHz.
- Banks are 2.5V LVCMOS.
- McGill Digital fMUX FPGA Motherboard
- Banks 11 & 12
- 03
- N.Starinski, UdeM
- (in symbol XC4VLX100-11FF1148C, part F) Bank 11; Bank 12

### Library data of the parts
R26-R29 = Res Semi: Semiconductor Resistor; Published: 8-Jun-2000; LatestRevisionDate: 17-Jul-2002; LatestRevisionNote: Re-released for DXP Platform.; Publisher: Altium Limited
U1 = XC4VLX100-11FF1148C: as U1 on sheet Banks_7_8; Published: 13-Dec-2004; LatestRevisionDate: 4-Mar-2005; LatestRevisionNote: D_IN & CS_B pins changed from I/O to Input. DOUT_BUSY pin changed from I/O to Output.; DatasheetDocument: ver1.2, Dec-2004; PackageReference: FF1148; Publisher: Altium Limited; ComponentLink2Description: Virtex-4 Overview; ComponentLink2URL: http://www.xilinx.com/products/virtex4/overview.htm; ComponentLink3Description: Datasheet; ComponentLink3URL: http://direct.xilinx.com/bvdocs/userguides/ug075.pdf; Code_JEDEC: MS-034-AAR-1

## Sheet Banks_13_14.SchDoc: FPGA Motherboard for Digital Multiplexed Readout, McGill U.
size B; DocumentNumber: DfMUX8; Revision: Rev0, Prototype; SheetNumber: 8; SheetTotal: 27; PageSetup: Record=PageOptions|CenterHorizontal=True|CenterVertical=True|PrintScale=1.08|XCorrection=1.00|YCorrection=1.00|PrintKind=0|BorderSize=5000000|LeftOffset=0|BottomOffset=0|Orientation=2|PaperLength=1000|PaperWidth=1000|Scale=100|PaperSource=7|PrintQuality=-4|MediaType=1|DitherType=10|PaperKind=Tabloid|PrintScaleMode=1
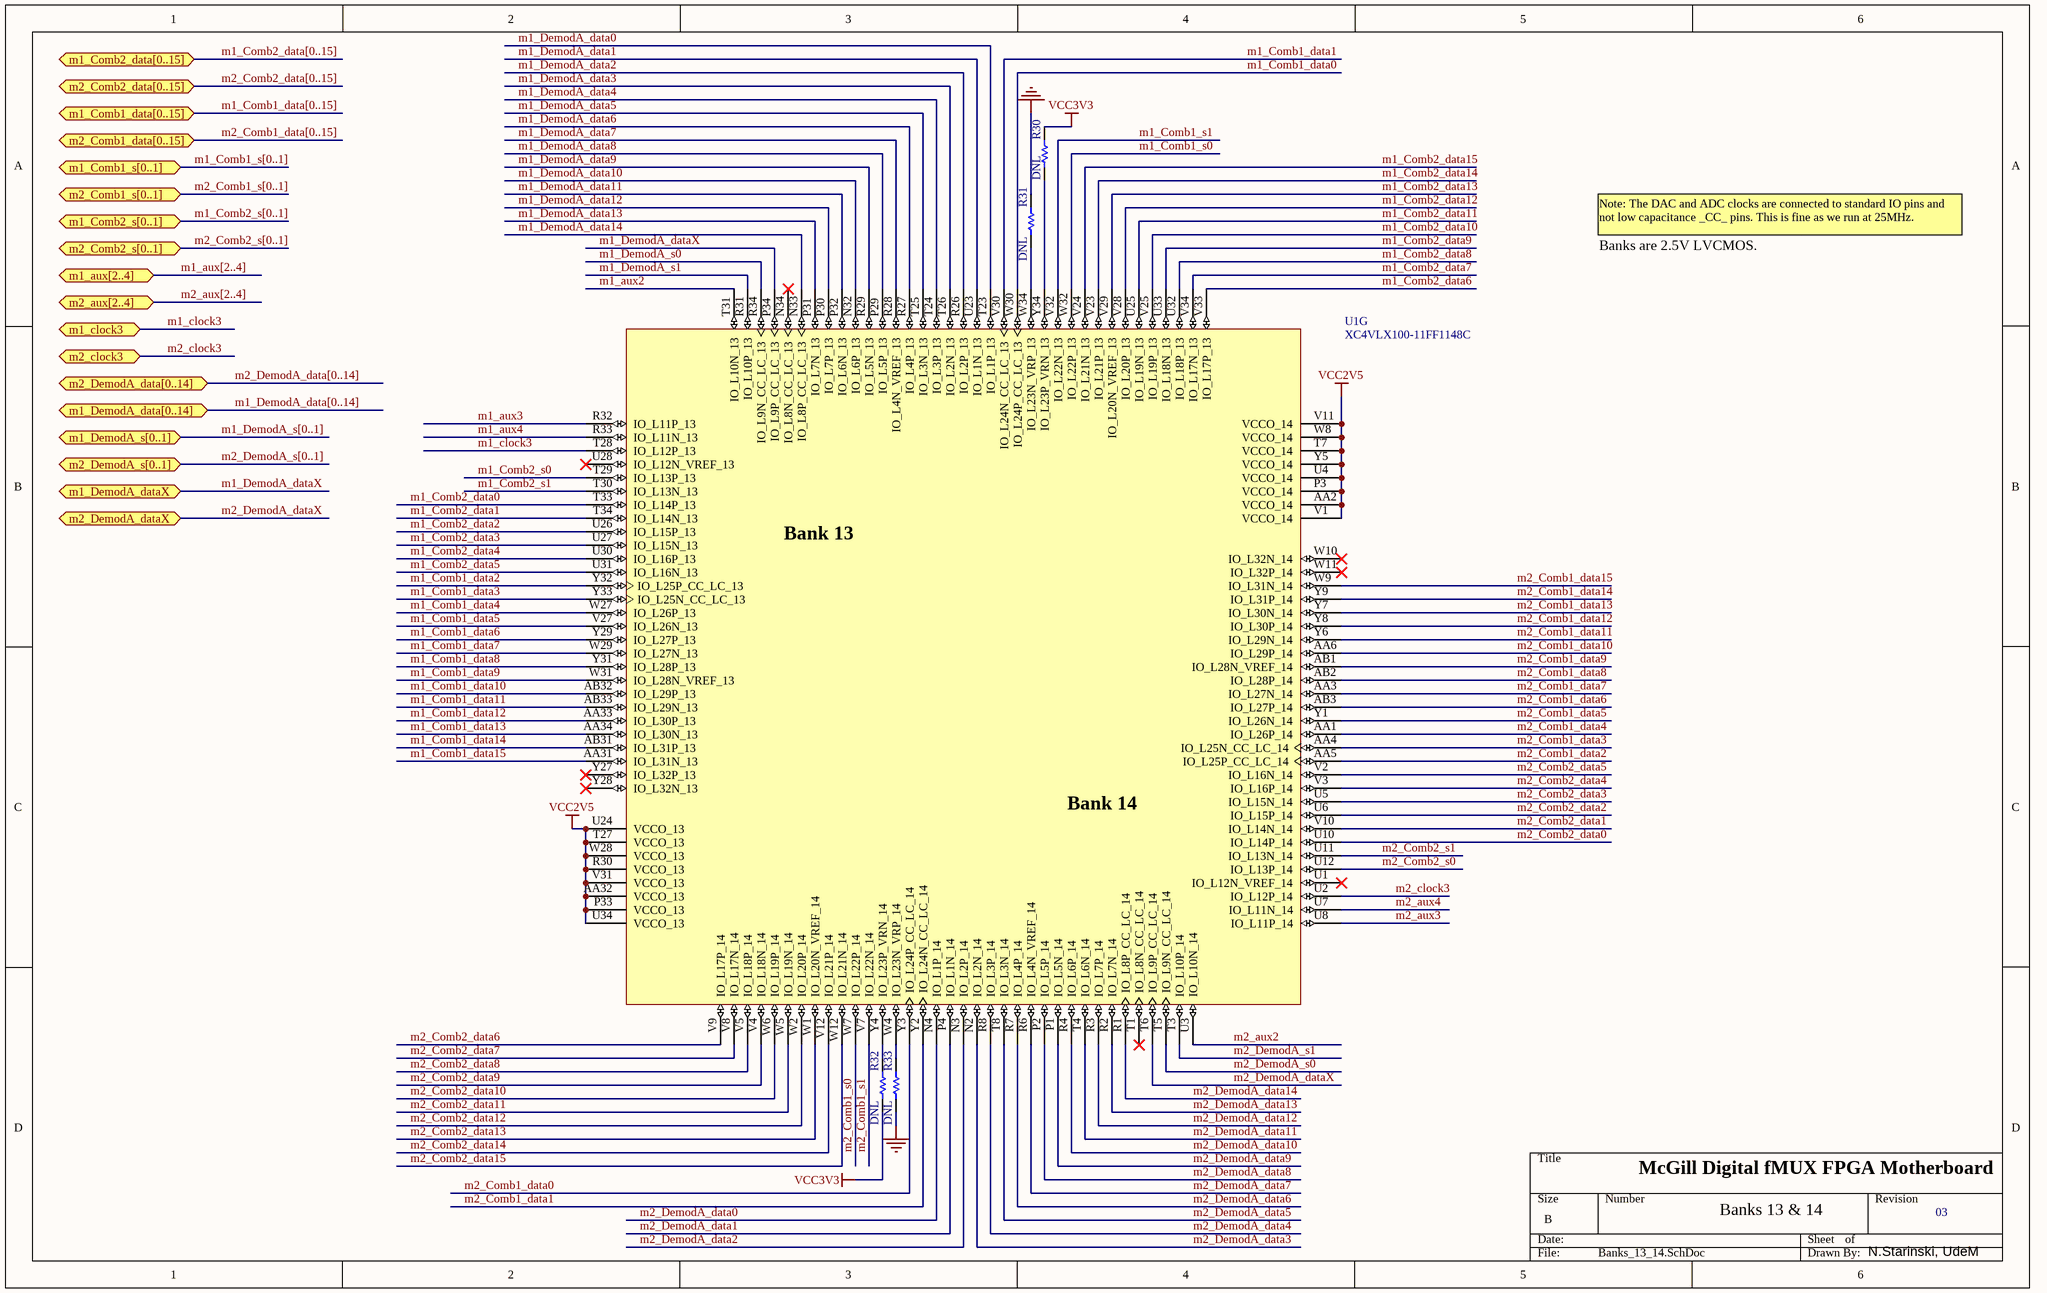
[diagram p7: Banks_13_14.SchDoc]

### Parts
R30  DNL  [CR1608-0603]
R31  DNL  [CR1608-0603]
R32  DNL  [CR1608-0603]
R33  DNL  [CR1608-0603]
U1  XC4VLX100-11FF1148C  [FF1148]  (part G of 10)

### Ports
m1_aux[2..4] (bidir), m1_clock3 (bidir), m1_Comb1_data[0..15] (bidir), m1_Comb1_s[0..1] (bidir), m1_Comb2_data[0..15] (bidir), m1_Comb2_s[0..1] (bidir), m1_DemodA_data[0..14] (bidir), m1_DemodA_dataX (bidir), m1_DemodA_s[0..1] (bidir), m2_aux[2..4] (bidir), m2_clock3 (bidir), m2_Comb1_data[0..15] (bidir), m2_Comb1_s[0..1] (bidir), m2_Comb2_data[0..15] (bidir), m2_Comb2_s[0..1] (bidir), m2_DemodA_data[0..14] (bidir), m2_DemodA_dataX (bidir), m2_DemodA_s[0..1] (bidir)

### Nets
GND: R31.2 R33.1
VCC2V5: U1.AA2(VCCO_14) U1.AA32(VCCO_13) U1.P3(VCCO_14) U1.P33(VCCO_13) U1.R30(VCCO_13) U1.T7(VCCO_14) U1.T27(VCCO_13) U1.U4(VCCO_14) U1.U24(VCCO_13) U1.U34(VCCO_13) U1.V1(VCCO_14) U1.V11(VCCO_14) U1.V31(VCCO_13) U1.W8(VCCO_14) U1.W28(VCCO_13) U1.Y5(VCCO_14)  [project net Vout2]
VCC3V3: R30.2 R32.1
m1_aux2: U1.T31(IO_L10N_13)
m1_aux3: U1.R32(IO_L11P_13)
m1_aux4: U1.R33(IO_L11N_13)
m1_clock3: U1.T28(IO_L12P_13) ; port m1_clock3
m1_Comb1_data0: U1.W30(IO_L24P_CC_LC_13)
m1_Comb1_data1: U1.V30(IO_L24N_CC_LC_13)
m1_Comb1_data2: U1.Y32(IO_L25P_CC_LC_13)
m1_Comb1_data3: U1.Y33(IO_L25N_CC_LC_13)
m1_Comb1_data4: U1.W27(IO_L26P_13)
m1_Comb1_data5: U1.V27(IO_L26N_13)
m1_Comb1_data6: U1.Y29(IO_L27P_13)
m1_Comb1_data7: U1.W29(IO_L27N_13)
m1_Comb1_data8: U1.Y31(IO_L28P_13)
m1_Comb1_data9: U1.W31(IO_L28N_VREF_13)
m1_Comb1_data10: U1.AB32(IO_L29P_13)
m1_Comb1_data11: U1.AB33(IO_L29N_13)
m1_Comb1_data12: U1.AA33(IO_L30P_13)
m1_Comb1_data13: U1.AA34(IO_L30N_13)
m1_Comb1_data14: U1.AB31(IO_L31P_13)
m1_Comb1_data15: U1.AA31(IO_L31N_13)
m1_Comb1_s0: U1.W32(IO_L22P_13)
m1_Comb1_s1: U1.V32(IO_L22N_13)
m1_Comb2_data0: U1.T33(IO_L14P_13)
m1_Comb2_data1: U1.T34(IO_L14N_13)
m1_Comb2_data2: U1.U26(IO_L15P_13)
m1_Comb2_data3: U1.U27(IO_L15N_13)
m1_Comb2_data4: U1.U30(IO_L16P_13)
m1_Comb2_data5: U1.U31(IO_L16N_13)
m1_Comb2_data6: U1.V33(IO_L17P_13)
m1_Comb2_data7: U1.V34(IO_L17N_13)
m1_Comb2_data8: U1.U32(IO_L18P_13)
m1_Comb2_data9: U1.U33(IO_L18N_13)
m1_Comb2_data10: U1.V25(IO_L19P_13)
m1_Comb2_data11: U1.U25(IO_L19N_13)
m1_Comb2_data12: U1.V28(IO_L20P_13)
m1_Comb2_data13: U1.V29(IO_L20N_VREF_13)
m1_Comb2_data14: U1.V23(IO_L21P_13)
m1_Comb2_data15: U1.V24(IO_L21N_13)
m1_Comb2_s0: U1.T29(IO_L13P_13)
m1_Comb2_s1: U1.T30(IO_L13N_13)
m1_DemodA_data0: U1.T23(IO_L1P_13)
m1_DemodA_data1: U1.U23(IO_L1N_13)
m1_DemodA_data2: U1.R26(IO_L2P_13)
m1_DemodA_data3: U1.T26(IO_L2N_13)
m1_DemodA_data4: U1.T24(IO_L3P_13)
m1_DemodA_data5: U1.T25(IO_L3N_13)
m1_DemodA_data6: U1.R27(IO_L4P_13)
m1_DemodA_data7: U1.R28(IO_L4N_VREF_13)
m1_DemodA_data8: U1.P29(IO_L5P_13)
m1_DemodA_data9: U1.R29(IO_L5N_13)
m1_DemodA_data10: U1.N32(IO_L6P_13)
m1_DemodA_data11: U1.P32(IO_L6N_13)
m1_DemodA_data12: U1.P30(IO_L7P_13)
m1_DemodA_data13: U1.P31(IO_L7N_13)
m1_DemodA_data14: U1.N33(IO_L8P_CC_LC_13)
m1_DemodA_dataX: U1.P34(IO_L9P_CC_LC_13) ; port m1_DemodA_dataX
m1_DemodA_s0: U1.R34(IO_L9N_CC_LC_13)
m1_DemodA_s1: U1.R31(IO_L10P_13)
m2_aux2: U1.U3(IO_L10N_14)
m2_aux3: U1.U8(IO_L11P_14)
m2_aux4: U1.U7(IO_L11N_14)
m2_clock3: U1.U2(IO_L12P_14) ; port m2_clock3
m2_Comb1_data0: U1.Y3(IO_L24P_CC_LC_14)
m2_Comb1_data1: U1.Y2(IO_L24N_CC_LC_14)
m2_Comb1_data2: U1.AA5(IO_L25P_CC_LC_14)
m2_Comb1_data3: U1.AA4(IO_L25N_CC_LC_14)
m2_Comb1_data4: U1.AA1(IO_L26P_14)
m2_Comb1_data5: U1.Y1(IO_L26N_14)
m2_Comb1_data6: U1.AB3(IO_L27P_14)
m2_Comb1_data7: U1.AA3(IO_L27N_14)
m2_Comb1_data8: U1.AB2(IO_L28P_14)
m2_Comb1_data9: U1.AB1(IO_L28N_VREF_14)
m2_Comb1_data10: U1.AA6(IO_L29P_14)
m2_Comb1_data11: U1.Y6(IO_L29N_14)
m2_Comb1_data12: U1.Y8(IO_L30P_14)
m2_Comb1_data13: U1.Y7(IO_L30N_14)
m2_Comb1_data14: U1.Y9(IO_L31P_14)
m2_Comb1_data15: U1.W9(IO_L31N_14)
m2_Comb1_s0: U1.W7(IO_L22P_14)
m2_Comb1_s1: U1.V7(IO_L22N_14)
m2_Comb2_data0: U1.U10(IO_L14P_14)
m2_Comb2_data1: U1.V10(IO_L14N_14)
m2_Comb2_data2: U1.U6(IO_L15P_14)
m2_Comb2_data3: U1.U5(IO_L15N_14)
m2_Comb2_data4: U1.V3(IO_L16P_14)
m2_Comb2_data5: U1.V2(IO_L16N_14)
m2_Comb2_data6: U1.V9(IO_L17P_14)
m2_Comb2_data7: U1.V8(IO_L17N_14)
m2_Comb2_data8: U1.V5(IO_L18P_14)
m2_Comb2_data9: U1.V4(IO_L18N_14)
m2_Comb2_data10: U1.W6(IO_L19P_14)
m2_Comb2_data11: U1.W5(IO_L19N_14)
m2_Comb2_data12: U1.W2(IO_L20P_14)
m2_Comb2_data13: U1.W1(IO_L20N_VREF_14)
m2_Comb2_data14: U1.V12(IO_L21P_14)
m2_Comb2_data15: U1.W12(IO_L21N_14)
m2_Comb2_s0: U1.U12(IO_L13P_14)
m2_Comb2_s1: U1.U11(IO_L13N_14)
m2_DemodA_data0: U1.N4(IO_L1P_14)
m2_DemodA_data1: U1.P4(IO_L1N_14)
m2_DemodA_data2: U1.N3(IO_L2P_14)
m2_DemodA_data3: U1.N2(IO_L2N_14)
m2_DemodA_data4: U1.R8(IO_L3P_14)
m2_DemodA_data5: U1.T8(IO_L3N_14)
m2_DemodA_data6: U1.R7(IO_L4P_14)
m2_DemodA_data7: U1.R6(IO_L4N_VREF_14)
m2_DemodA_data8: U1.P2(IO_L5P_14)
m2_DemodA_data9: U1.P1(IO_L5N_14)
m2_DemodA_data10: U1.R4(IO_L6P_14)
m2_DemodA_data11: U1.T4(IO_L6N_14)
m2_DemodA_data12: U1.R3(IO_L7P_14)
m2_DemodA_data13: U1.R2(IO_L7N_14)
m2_DemodA_data14: U1.R1(IO_L8P_CC_LC_14)
m2_DemodA_dataX: U1.T6(IO_L9P_CC_LC_14) ; port m2_DemodA_dataX
m2_DemodA_s0: U1.T5(IO_L9N_CC_LC_14)
m2_DemodA_s1: U1.T3(IO_L10P_14)
NetR30_1: R30.1 U1.Y34(IO_L23P_VRN_13)
NetR31_1: R31.1 U1.W34(IO_L23N_VRP_13)
NetR32_2: R32.2 U1.Y4(IO_L23P_VRN_14)
NetR33_2: R33.2 U1.W4(IO_L23N_VRP_14)

Not connected (* = marked no-connect by the designer): U1 N34(IO_L8N_CC_LC_13)* T1(IO_L8N_CC_LC_14)* U1(IO_L12N_VREF_14)* U28(IO_L12N_VREF_13)* W10(IO_L32N_14)* W11(IO_L32P_14)* Y27(IO_L32P_13)* Y28(IO_L32N_13)*

### Buses and harness runs
bus m1_aux[2..4] = port m1_aux[2..4]
bus m1_Comb1_data[0..15] = port m1_Comb1_data[0..15]
bus m1_Comb1_s[0..1] = port m1_Comb1_s[0..1]
bus m1_Comb2_data[0..15] = port m1_Comb2_data[0..15]
bus m1_Comb2_s[0..1] = port m1_Comb2_s[0..1]
bus m1_DemodA_data[0..14] = port m1_DemodA_data[0..14]
bus m1_DemodA_s[0..1] = port m1_DemodA_s[0..1]
bus m2_aux[2..4] = port m2_aux[2..4]
bus m2_Comb1_data[0..15] = port m2_Comb1_data[0..15]
bus m2_Comb1_s[0..1] = port m2_Comb1_s[0..1]
bus m2_Comb2_data[0..15] = port m2_Comb2_data[0..15]
bus m2_Comb2_s[0..1] = port m2_Comb2_s[0..1]
bus m2_DemodA_data[0..14] = port m2_DemodA_data[0..14]
bus m2_DemodA_s[0..1] = port m2_DemodA_s[0..1]

### Notes on the sheet
- Note: The DAC and ADC clocks are connected to standard IO pins and not low capacitance _CC_ pins. This is fine as we run at 25MHz.
- Banks are 2.5V LVCMOS.
- McGill Digital fMUX FPGA Motherboard
- Banks 13 & 14
- 03
- N.Starinski, UdeM
- (in symbol XC4VLX100-11FF1148C, part G) Bank 13; Bank 14

### Library data of the parts
R30-R33 = Res Semi: Semiconductor Resistor; Published: 8-Jun-2000; LatestRevisionDate: 17-Jul-2002; LatestRevisionNote: Re-released for DXP Platform.; Publisher: Altium Limited
U1 = XC4VLX100-11FF1148C: as U1 on sheet Banks_7_8; Published: 13-Dec-2004; LatestRevisionDate: 4-Mar-2005; LatestRevisionNote: D_IN & CS_B pins changed from I/O to Input. DOUT_BUSY pin changed from I/O to Output.; DatasheetDocument: ver1.2, Dec-2004; PackageReference: FF1148; Publisher: Altium Limited; ComponentLink2Description: Virtex-4 Overview; ComponentLink2URL: http://www.xilinx.com/products/virtex4/overview.htm; ComponentLink3Description: Datasheet; ComponentLink3URL: http://direct.xilinx.com/bvdocs/userguides/ug075.pdf; Code_JEDEC: MS-034-AAR-1

## Sheet Power_Delivery.SchDoc: FPGA Motherboard for Digital Multiplexed Readout, McGill U.
size Letter; DocumentNumber: DfMUX21; Revision: Rev0, Prototype; SheetNumber: 21; SheetTotal: 27; PageSetup: Record=PageOptions|CenterHorizontal=True|CenterVertical=True|PrintScale=0.93|XCorrection=1.00|YCorrection=1.00|PrintKind=0|BorderSize=5000000|LeftOffset=0|BottomOffset=0|Orientation=2|PaperLength=1000|PaperWidth=1000|Scale=100|PaperSource=7|PrintQuality=-4|MediaType=1|DitherType=10|PaperKind=Letter|PrintScaleMode=1
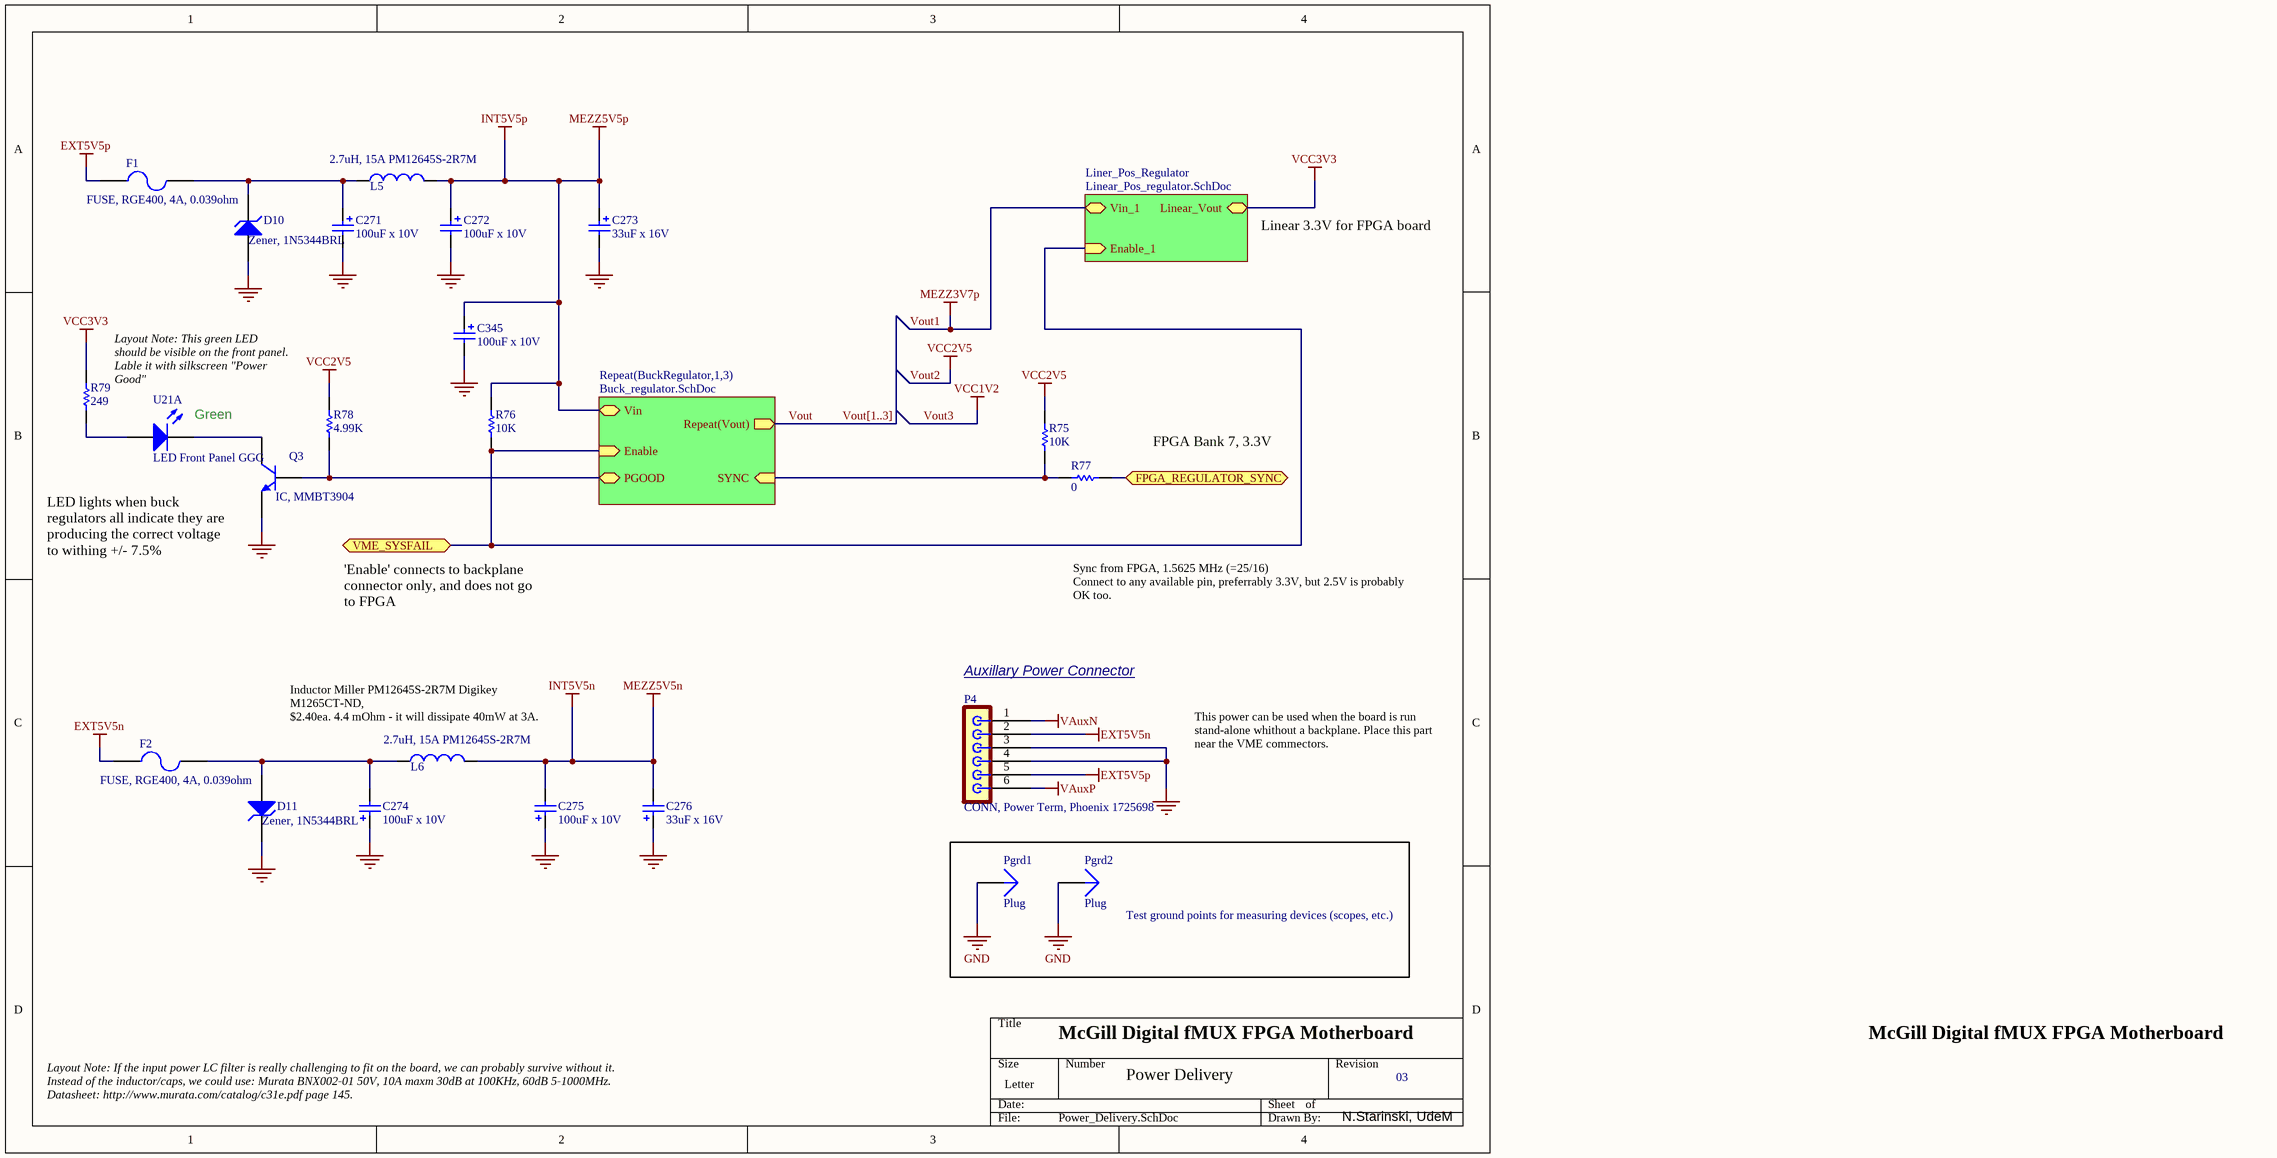
[diagram p8: Power_Delivery.SchDoc]

### Parts
C271  100uF x 10V  [TC6032-2412]
C272  100uF x 10V  [TC6032-2412]
C273  33uF x 16V  [CC4532-1812]
C274  100uF x 10V  [TC6032-2412]
C275  100uF x 10V  [TC6032-2412]
C276  33uF x 16V  [CC4532-1812]
C345  100uF x 10V  [TC6032-2412]
D10  Zener, 1N5344BRL  [DIODE-0.7]
D11  Zener, 1N5344BRL  [DIODE-0.7]
F1  FUSE, RGE400, 4A, 0.039ohm  [Fuse 5.88mm]
F2  FUSE, RGE400, 4A, 0.039ohm  [Fuse 5.88mm]
L5  2.7uH, 15A PM12645S-2R7M  [MLC_inductor]
L6  2.7uH, 15A PM12645S-2R7M  [MLC_inductor]
P4  CONN, Power Term, Phoenix 1725698  [TrmBlk6]
Pgrd1  Plug  [PIN1]
Pgrd2  Plug  [PIN1]
Q3  IC, MMBT3904  [SOT23]
R75  10K  [CR1608-0603]
R76  10K  [CR1608-0603]
R77  0  [CR1608-0603]
R78  4.99K  [CR1608-0603]
R79  249  [CR1608-0603]
U21  LED Front Panel GGG  [LED_Tri_]  (part A of 3)

### Blocks framed on the sheet
Test ground points for measuring devices (scopes, etc.): Pgrd1 Pgrd2

### Sub-sheets
Liner_Pos_Regulator = Linear_Pos_regulator.SchDoc: Vin_1, Enable_1 (in), Linear_Vout
Repeat(BuckRegulator,1,3) = Buck_regulator.SchDoc: Vin, Enable (in), PGOOD (bidir), Repeat(Vout) (out), SYNC (in)

### Ports
FPGA_REGULATOR_SYNC (bidir), VME_SYSFAIL (bidir)

### Nets
EXT5V5n: F2.1 P4.2
EXT5V5p: F1.1 P4.5
GND: C271.2 C272.2 C273.2 C274.1 C275.1 C276.1 C345.2 D10.1(A) D11.2(K) P4.3 P4.4 Pgrd1.1 Pgrd2.1 Q3.2(E)
INT5V5n: C275.2 C276.2 L6.2  [also labelled MEZZ5V5n]
INT5V5p: C272.1 C273.1 C345.1 L5.2 R76.2 ; sheet Repeat(BuckRegulator,1,3)/Vin  [also labelled MEZZ5V5p]
VAuxN: P4.1
VAuxP: P4.6
VCC3V3: R79.2 ; sheet Liner_Pos_Regulator/Linear_Vout
Vout2: R75.2 R78.2  [also labelled VCC2V5]
FPGA_REGULATOR_SYNC: R77.2 ; port FPGA_REGULATOR_SYNC
VME_SYSFAIL: R76.1 ; port VME_SYSFAIL, sheet Repeat(BuckRegulator,1,3)/Enable, sheet Liner_Pos_Regulator/Enable_1
Vout: sheet Repeat(BuckRegulator,1,3)/Repeat(Vout)
NetC271_1: C271.1 D10.2(K) F1.2 L5.1
NetC274_2: C274.2 D11.1(A) F2.2 L6.1
NetQ3_1: Q3.1(B) R78.1 ; sheet Repeat(BuckRegulator,1,3)/PGOOD
NetQ3_3: Q3.3(C) U21.K1(K)
NetR75_1: R75.1 R77.1 ; sheet Repeat(BuckRegulator,1,3)/SYNC
NetR79_1: R79.1 U21.A1(A)

### Buses and harness runs
bus Vout[1..3]

### Notes on the sheet
- Linear 3.3V for FPGA board
- (near R79) Layout Note: This green LED should be visible on the front panel. Lable it with silkscreen "Power Good"
- (near U21) Green
- FPGA Bank 7, 3.3V
- (near Q3) LED lights when buck regulators all indicate they are producing the correct voltage to withing +/- 7.5%
- 'Enable' connects to backplane connector only, and does not go to FPGA
- Sync from FPGA, 1.5625 MHz (=25/16)
  Connect to any available pin, preferrably 3.3V, but 2.5V is probably OK too.
- (near P4) Auxillary Power Connector
- (near L6) Inductor Miller PM12645S-2R7M Digikey M1265CT-ND,
  $2.40ea. 4.4 mOhm - it will dissipate 40mW at 3A.
- This power can be used when the board is run stand-alone whithout a backplane. Place this part near the VME commectors.
- McGill Digital fMUX FPGA Motherboard
- Layout Note: If the input power LC filter is really challenging to fit on the board, we can probably survive without it.
  Instead of the inductor/caps, we could use: Murata BNX002-01 50V, 10A maxm 30dB at 100KHz, 60dB 5-1000MHz.
  Datasheet: http://www.murata.com/catalog/c31e.pdf page 145.
- Power Delivery
- 03
- N.Starinski, UdeM

### Library data of the parts
C271 C272 C274 C275 C345 = Cap Pol3: CAP TANTC TPSC107K010R0075; Published: 8-Jun-2000; LatestRevisionDate: 17-Jul-2002; LatestRevisionNote: Re-released for DXP Platform.; PackageReference: C0805; Publisher: Altium Limited
C273 C276 = Cap Pol3: CAP POL C4532X5R1C336M; Published: 8-Jun-2000; LatestRevisionDate: 17-Jul-2002; LatestRevisionNote: Re-released for DXP Platform.; PackageReference: C0805; Publisher: Altium Limited
D10 D11 = D Zener: Zener Diode, 8.2V, 5W; Published: 8-Jun-2000; LatestRevisionDate: 17-Jul-2002; LatestRevisionNote: Re-released for DXP Platform.; Publisher: Altium Limited
F1 F2 = Fuse 2: Fuse; Published: 8-Jun-2000; LatestRevisionDate: 17-Jul-2002; LatestRevisionNote: Re-released for DXP Platform.; Publisher: Altium Limited
L5 L6 = Inductor: Code_IEC: 1005; Published: 8-Jun-2000; LatestRevisionDate: 17-Jul-2002; LatestRevisionNote: Re-released for DXP Platform.; PackageReference: 0402-A; Publisher: Altium Limited; Code_JEITA: 0402
P4 = TrmBlk_6pos: MPT 0.5/6-2.54 Terminal Block
Q3 = MMBT3904: NPN Switching Transistor; Published: 17-Sep-2003; DatasheetDocument: 13-May-2002; PackageDocument: May-1999; PackageReference: SOT23; Publisher: Altium Limited; ComponentLink1Description: Manufacturer Link; ComponentLink1URL: http://www.semiconductors.philips.com/; ComponentLink2Description: Datasheet; ComponentLink2URL: http://www.semiconductors.philips.com/acrobat/datasheets/MMBT3904_4.pdf
R75-R79 = Res Semi: Resistor 0603; Published: 8-Jun-2000; LatestRevisionDate: 17-Jul-2002; LatestRevisionNote: Re-released for DXP Platform.; Publisher: Altium Limited
U21 = LED_Tri: 564-0200-222F
Pgrd1 Pgrd2 = Plug: LatestRevisionDate: 17-Jul-2002; LatestRevisionNote: Re-released for DXP Platform.; Publisher: Altium Limited

## Sheet Buck_regulator.SchDoc: FPGA Motherboard for Digital Multiplexed Readout, McGill U.
size A; DocumentNumber: DfMUX22; Revision: Rev0, Prototype; SheetNumber: 22; SheetTotal: 27; PageSetup: Record=PageOptions|CenterHorizontal=True|CenterVertical=True|PrintScale=1.05|XCorrection=1.00|YCorrection=1.00|PrintKind=0|BorderSize=5000000|LeftOffset=0|BottomOffset=0|Orientation=2|PaperLength=1000|PaperWidth=1000|Scale=100|PaperSource=7|PrintQuality=-4|MediaType=1|DitherType=10|PaperKind=Letter|PrintScaleMode=1
Used 3 times, as channels U_Power_Delivery/BuckRegulator1, U_Power_Delivery/BuckRegulator2, U_Power_Delivery/BuckRegulator3. Parts and nets are listed once, with the designators drawn on the sheet.
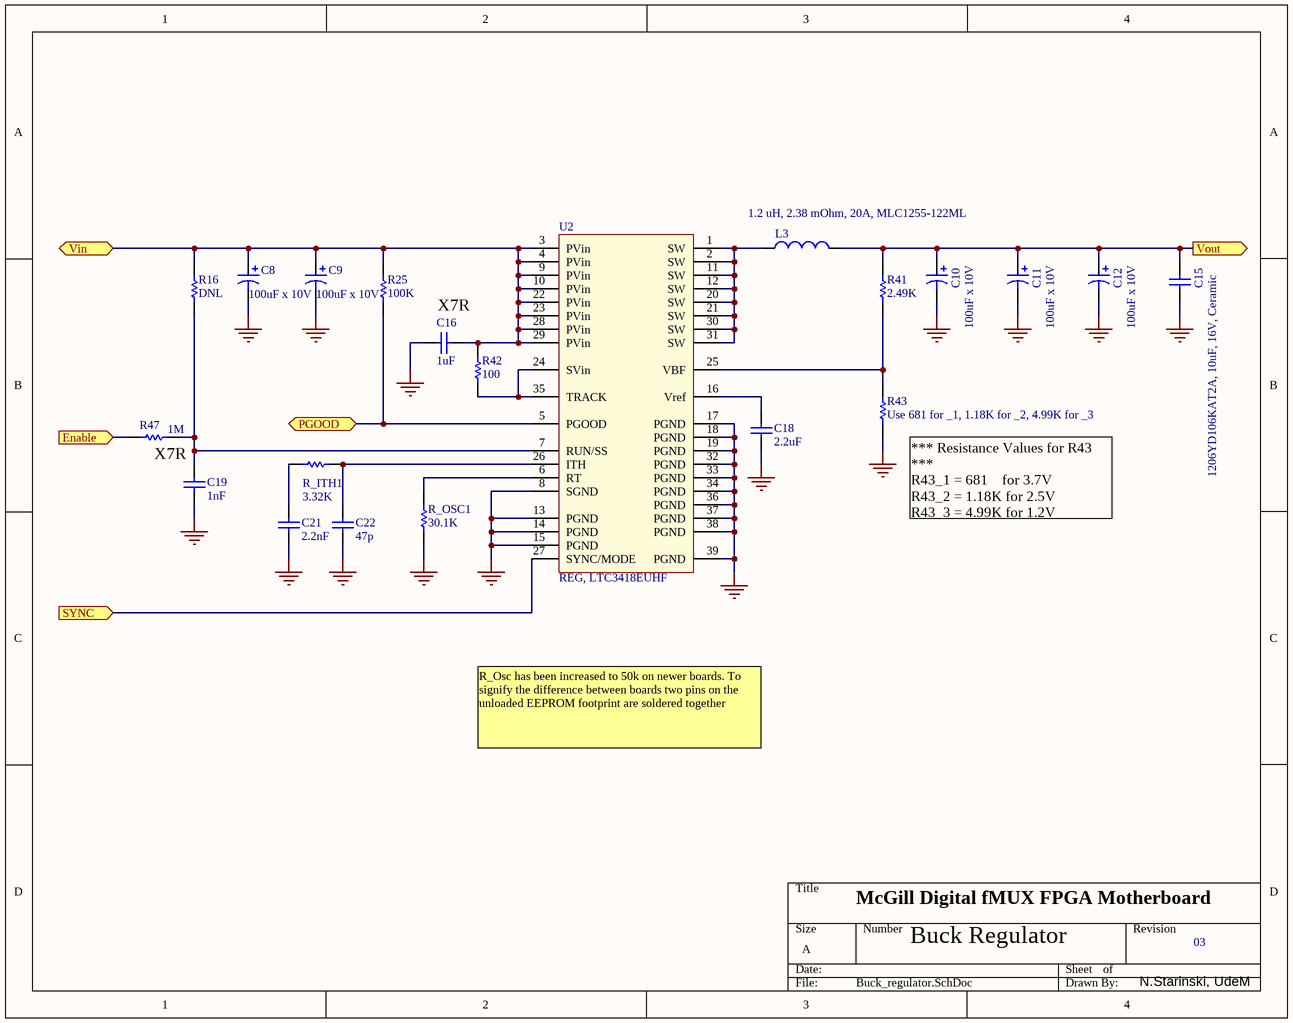
[diagram p9: Buck_regulator.SchDoc]

### Parts
C8  100uF x 10V  [TC6032-2412]
C9  100uF x 10V  [TC6032-2412]
C10  100uF x 10V  [TC6032-2412]
C11  100uF x 10V  [TC6032-2412]
C12  100uF x 10V  [TC6032-2412]
C15  1206YD106KAT2A, 10uF, 16V, Ceramic  [CC3225-1210]
C16  1uF  [CC1608-0603]
C18  2.2uF  [CC3225-1210]
C19  1nF  [CC1608-0603]
C21  2.2nF  [CC1608-0603]
C22  47p  [CC1608-0603]
L3  1.2 uH, 2.38 mOhm, 20A, MLC1255-122ML  [MLC_inductor]
R16  DNL  [CR1608-0603]
R25  100K  [CR1608-0603]
R41  2.49K  [CR1608-0603]
R42  100  [CR1608-0603]
R43  Use 681 for _1, 1.18K for _2, 4.99K for _3  [CR1608-0603]
R47  1M  [CR1608-0603]
R_ITH1  3.32K  [CR1608-0603]
R_OSC1  30.1K  [CR1608-0603]
U2  REG, LTC3418EUHF  [UH38_N]

### Ports
Enable (in), PGOOD (bidir), SYNC (in), Vin, Vout (out)

### Nets
GND: C8.2 C9.2 C10.2 C11.2 C12.2 C15.2 C16.1 C18.1 C19.1 C21.1 C22.1 R43.1 R_OSC1.1 U2.8(SGND) U2.13(PGND) U2.14(PGND) U2.15(PGND) U2.17(PGND) U2.18(PGND) U2.19(PGND) U2.32(PGND) U2.33(PGND) U2.34(PGND) U2.36(PGND) U2.37(PGND) U2.38(PGND) U2.39(PGND)
Enable: R47.1 ; port Enable
PGOOD: R25.1 U2.5(PGOOD) ; port PGOOD
SYNC: U2.27(SYNC/MODE) ; port SYNC
Vin: C8.1 C9.1 C16.2 R16.2 R25.2 R42.2 U2.3(PVin) U2.4(PVin) U2.9(PVin) U2.10(PVin) U2.22(PVin) U2.23(PVin) U2.28(PVin) U2.29(PVin) ; port Vin
Vout: C10.1 C11.1 C12.1 C15.1 L3.2 R41.2 ; port Vout
NetC18_2: C18.2 U2.16(Vref)
NetC19_2: C19.2 R16.1 R47.2 U2.7(RUN/SS)
NetC21_2: C21.2 R_ITH1.1
NetC22_2: C22.2 R_ITH1.2 U2.26(ITH)
NetL3_1: L3.1 U2.1(SW) U2.2(SW) U2.11(SW) U2.12(SW) U2.20(SW) U2.21(SW) U2.30(SW) U2.31(SW)
NetR41_1: R41.1 R43.2 U2.25(VBF)
NetR42_1: R42.1 U2.24(SVin) U2.35(TRACK)
NetR_OSC1_2: R_OSC1.2 U2.6(RT)

### Channels
U_Power_Delivery/BuckRegulator1: designators end in _1; ports Enable=VME_SYSFAIL PGOOD=NetQ3_1 SYNC=NetR75_1 Vin=INT5V5p Vout=Vout1
U_Power_Delivery/BuckRegulator2: designators end in _2; ports Enable=VME_SYSFAIL PGOOD=NetQ3_1 SYNC=NetR75_1 Vin=INT5V5p Vout=Vout2
U_Power_Delivery/BuckRegulator3: designators end in _3; ports Enable=VME_SYSFAIL PGOOD=NetQ3_1 SYNC=NetR75_1 Vin=INT5V5p Vout=Vout3

### Notes on the sheet
- X7R
- (near R47) X7R
- (near R43) *** Resistance Values for R43 ***
  R43_1 = 681    for 3.7V
  R43_2 = 1.18K for 2.5V
  R43_3 = 4.99K for 1.2V
- R_Osc has been increased to 50k on newer boards. To signify the difference between boards two pins on the unloaded EEPROM footprint are soldered together
- McGill Digital fMUX FPGA Motherboard
- Buck Regulator
- 03
- N.Starinski, UdeM

### Library data of the parts
C8-C12 = Cap Pol3: CAP TANTC TPSC107K010R0075; Published: 8-Jun-2000; LatestRevisionDate: 17-Jul-2002; LatestRevisionNote: Re-released for DXP Platform.; PackageReference: C0805; Publisher: Altium Limited
C15 = Cap Semi: CAP POL 1206YD106KAT2A; Published: 8-Jun-2000; LatestRevisionDate: 17-Jul-2002; LatestRevisionNote: Re-released for DXP Platform.; PackageReference: C1206; Publisher: Altium Limited
C16 C19 C21 C22 = Cap Semi: Capacitor (Semiconductor SIM Model); Published: 8-Jun-2000; LatestRevisionDate: 17-Jul-2002; LatestRevisionNote: Re-released for DXP Platform.; PackageReference: C1206; Publisher: Altium Limited
C18 = Cap Semi: Capacitor (use 1206 footprint); Published: 8-Jun-2000; LatestRevisionDate: 17-Jul-2002; LatestRevisionNote: Re-released for DXP Platform.; PackageReference: C1206; Publisher: Altium Limited
L3 = Inductor: Code_IEC: 1005; Published: 8-Jun-2000; LatestRevisionDate: 17-Jul-2002; LatestRevisionNote: Re-released for DXP Platform.; PackageReference: 0402-A; Publisher: Altium Limited; Code_JEITA: 0402
R16 R25 R42 R43 = Res Semi: Semiconductor Resistor; Published: 8-Jun-2000; LatestRevisionDate: 17-Jul-2002; LatestRevisionNote: Re-released for DXP Platform.; Publisher: Altium Limited
R41 R47 R_ITH1 R_OSC1 = Res Semi: Resistor 0603; Published: 8-Jun-2000; LatestRevisionDate: 17-Jul-2002; LatestRevisionNote: Re-released for DXP Platform.; Publisher: Altium Limited
U2 = LTC3418: 8A, 4MHz, Monolithic Syncronous Step-Down Regulator

## Sheet Linear_Pos_regulator.SchDoc: FPGA Motherboard for Digital Multiplexed Readout, McGill U.
size A; DocumentNumber: DfMUX23; Revision: Rev0, Prototype; SheetNumber: 23; SheetTotal: 27; PageSetup: Record=PageOptions|CenterHorizontal=True|CenterVertical=True|PrintScale=1.05|XCorrection=1.00|YCorrection=1.00|PrintKind=0|BorderSize=5000000|LeftOffset=0|BottomOffset=0|Orientation=2|PaperLength=1000|PaperWidth=1000|Scale=100|PaperSource=7|PrintQuality=-4|MediaType=1|DitherType=10|PaperKind=Letter|PrintScaleMode=1
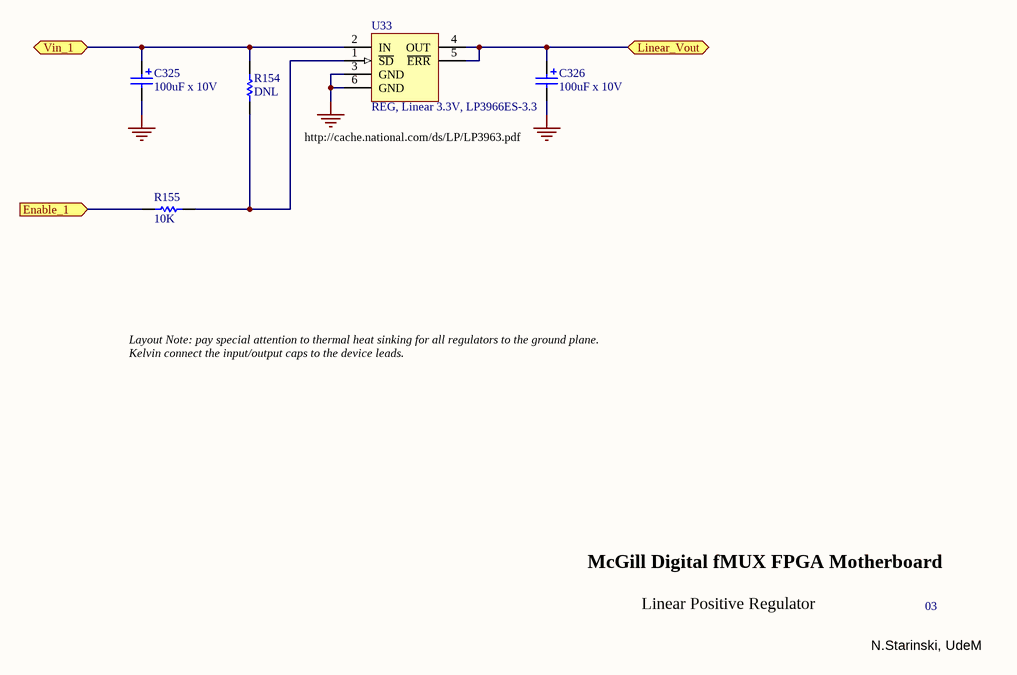
[diagram p10: Linear_Pos_regulator.SchDoc]

### Parts
C325  100uF x 10V  [TC6032-2412]
C326  100uF x 10V  [TC6032-2412]
R154  DNL  [CR1608-0603]
R155  10K  [CR1608-0603]
U33  REG, Linear 3.3V, LP3966ES-3.3  [TS5B]

### Ports
Enable_1 (in), Linear_Vout, Vin_1

### Nets
GND: C325.2 C326.2 U33.3(GND) U33.6(GND)
VCC3V3: C326.1 U33.4(OUT) U33.5(~{ERR}) ; port Linear_Vout
Vout1: C325.1 R154.2 U33.2(IN) ; port Vin_1
VME_SYSFAIL: R155.1 ; port Enable_1
NetR154_1: R154.1 R155.2 U33.1(~{SD})

### Notes on the sheet
- http://cache.national.com/ds/LP/LP3963.pdf
- Layout Note: pay special attention to thermal heat sinking for all regulators to the ground plane. Kelvin connect the input/output caps to the device leads.
- McGill Digital fMUX FPGA Motherboard
- Linear Positive Regulator
- 03
- N.Starinski, UdeM

### Library data of the parts
C325 C326 = Cap Pol3: CAP TANTC TPSC107K010R0075; Published: 8-Jun-2000; LatestRevisionDate: 17-Jul-2002; LatestRevisionNote: Re-released for DXP Platform.; PackageReference: C0805; Publisher: Altium Limited
R154 = Res Semi: Semiconductor Resistor; Published: 8-Jun-2000; LatestRevisionDate: 17-Jul-2002; LatestRevisionNote: Re-released for DXP Platform.; Publisher: Altium Limited
R155 = Res Semi: Resistor 0603; Published: 8-Jun-2000; LatestRevisionDate: 17-Jul-2002; LatestRevisionNote: Re-released for DXP Platform.; Publisher: Altium Limited
U33 = LP3966: 3A Fast Ultra Low Dropout Linear Regulator

## Sheet Clock_distrubution.SchDoc: FPGA Motherboard for Digital Multiplexed Readout, McGill U.
size A; DocumentNumber: DfMUX14; Revision: Rev0, Prototype; SheetNumber: 14; SheetTotal: 27; PageSetup: Record=PageOptions|CenterHorizontal=True|CenterVertical=True|PrintScale=1.05|XCorrection=1.00|YCorrection=1.00|PrintKind=0|BorderSize=5000000|LeftOffset=0|BottomOffset=0|Orientation=2|PaperLength=1000|PaperWidth=1000|Scale=100|PaperSource=7|PrintQuality=-4|MediaType=1|DitherType=10|PaperKind=Letter|PrintScaleMode=1
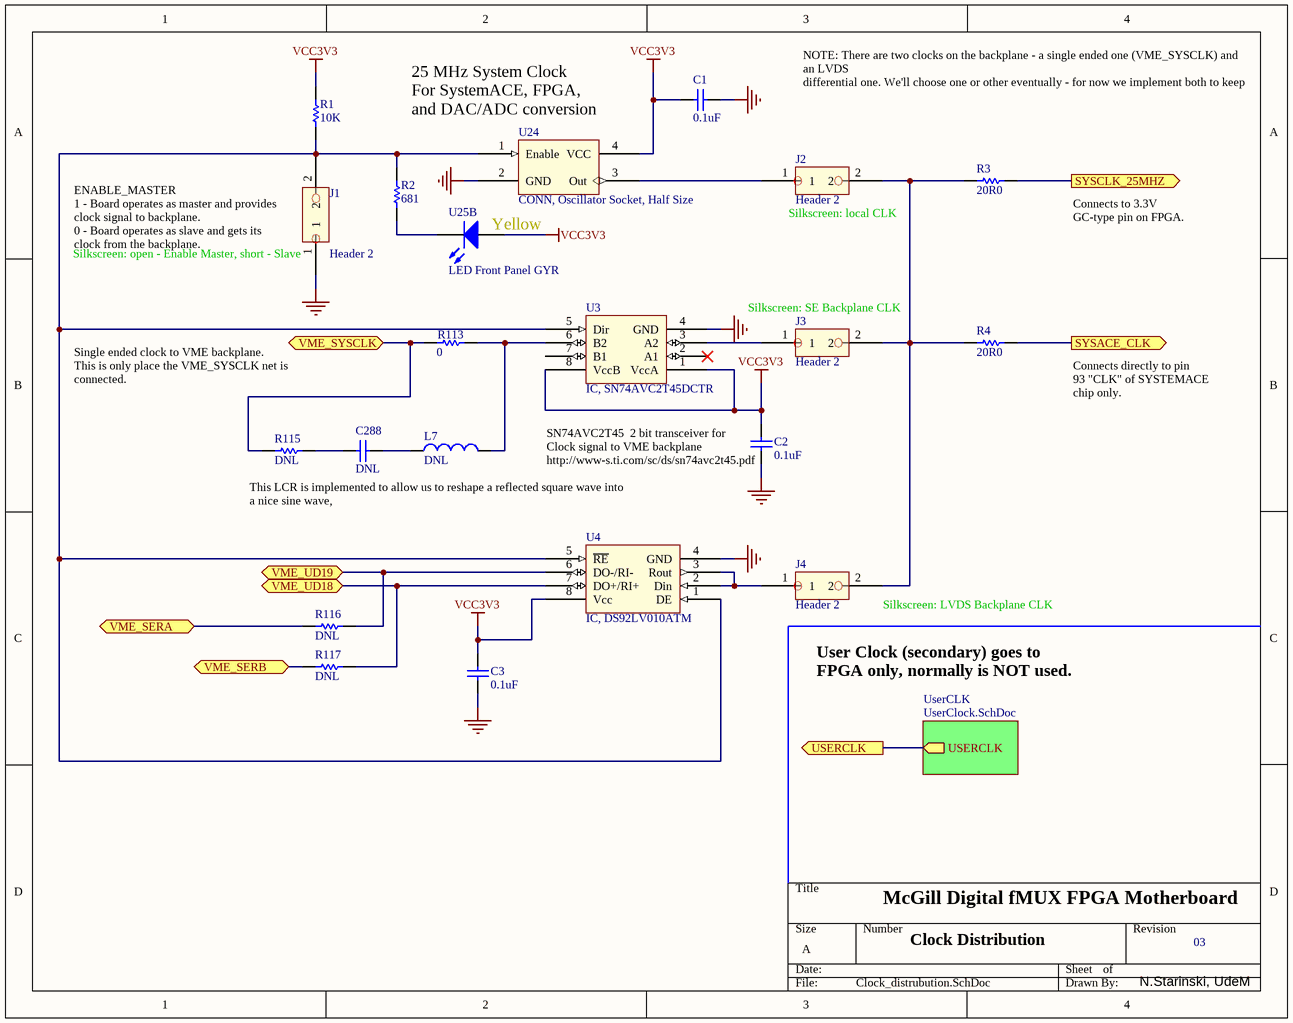
[diagram p11: Clock_distrubution.SchDoc]

### Parts
C1  0.1uF  [CC1608-0603]
C2  0.1uF  [CC1608-0603]
C3  0.1uF  [CC1608-0603]
C288  DNL  [CC1608-0603]
J1  Header 2  [HDR1X2]
J2  Header 2  [HDR1X2]
J3  Header 2  [HDR1X2]
J4  Header 2  [HDR1X2]
L7  DNL  [INDC2012-0805]
R1  10K  [CR1608-0603]
R2  681  [CR1608-0603]
R3  20R0  [CR1608-0603]
R4  20R0  [CR1608-0603]
R113  0  [CR1608-0603]
R115  DNL  [CR1608-0603]
R116  DNL  [CR1608-0603]
R117  DNL  [CR1608-0603]
U3  IC, SN74AVC2T45DCTR  [TSSO3x5-G8/X.35]
U4  IC, DS92LV010ATM  [SOP8]
U24  CONN, Oscillator Socket, Half Size  [DIP_Osc]
U25  LED Front Panel GYR  [LED_Tri_]  (part B of 3)

### Sub-sheets
UserCLK = UserClock.SchDoc: USERCLK (out)

### Ports
SYSACE_CLK (out), SYSCLK_25MHZ (out), USERCLK (out), VME_SERA (bidir), VME_SERB (bidir), VME_SYSCLK (bidir), VME_UD18 (bidir), VME_UD19 (bidir)

### Nets
GND: C1.2 C2.1 C3.1 J1.1 U3.4(GND) U4.4(GND) U24.2(GND)
VCC3V3: C1.1 C2.2 C3.2 R1.2 U3.1(VccA) U3.8(VccB) U4.8(Vcc) U24.4(VCC) U25.A2(A)
SYSACE_CLK: R4.2 ; port SYSACE_CLK
SYSCLK_25MHZ: R3.2 ; port SYSCLK_25MHZ
USERCLK: port USERCLK, sheet UserCLK/USERCLK
VME_SERA: R116.1 ; port VME_SERA
VME_SERB: R117.1 ; port VME_SERB
VME_SYSCLK: R113.1 R115.1 ; port VME_SYSCLK
VME_UD18: R117.2 U4.7(DO+/RI+) ; port VME_UD18
VME_UD19: R116.2 U4.6(DO-/RI-) ; port VME_UD19
NetC288_1: C288.1 R115.2
NetC288_2: C288.2 L7.1
NetJ1_2: J1.2 R1.1 R2.2 U3.5(Dir) U4.1(DE) U4.5(~{RE}) U24.1(Enable)
NetJ2_1: J2.1 U24.3(Out)
NetJ2_2: J2.2 J3.2 J4.2 R3.1 R4.1
NetJ3_1: J3.1 U3.3(A2)
NetJ4_1: J4.1 U4.2(Din) U4.3(Rout)
NetL7_2: L7.2 R113.2 U3.6(B2)
NetR2_1: R2.1 U25.K2(K)

Not connected (* = marked no-connect by the designer): U3 2(A1)* 7(B1)

### Notes on the sheet
- NOTE: There are two clocks on the backplane - a single ended one (VME_SYSCLK) and an LVDS
  differential one. We'll choose one or other eventually - for now we implement both to keep our options open.
- (near U24) 25 MHz System Clock
  For SystemACE, FPGA,
  and DAC/ADC conversion
- (near U25) Yellow
- (near J2) Silkscreen: local CLK
- Connects to 3.3V
  GC-type pin on FPGA.
- (near J1) ENABLE_MASTER
  1 - Board operates as master and provides clock signal to backplane.
  0 - Board operates as slave and gets its clock from the backplane.
- (near J1) Silkscreen: open - Enable Master, short - Slave
- (near J3) Silkscreen: SE Backplane CLK
- Single ended clock to VME backplane.
  This is only place the VME_SYSCLK net is connected.
- Connects directly to pin
  93 "CLK" of SYSTEMACE
  chip only.
- This LCR is implemented to allow us to reshape a reflected square wave into a nice sine wave,
  as suggested by JP Martin.
- (near C2) SN74AVC2T45  2 bit transceiver for Clock signal to VME backplane
  http://www-s.ti.com/sc/ds/sn74avc2t45.pdf
- (near J4) Silkscreen: LVDS Backplane CLK
- User Clock (secondary) goes to
  FPGA only, normally is NOT used.
- McGill Digital fMUX FPGA Motherboard
- Clock Distribution
- 03
- N.Starinski, UdeM

### Library data of the parts
C1-C3 C288 = Cap Semi: Capacitor (Semiconductor SIM Model); Published: 8-Jun-2000; LatestRevisionDate: 17-Jul-2002; LatestRevisionNote: Re-released for DXP Platform.; PackageReference: C1206; Publisher: Altium Limited
J1-J4 = Jumper_100mil: Header, 0.1" 2-Pin straight
L7 = Inductor: Code_IEC: 1005; Published: 8-Jun-2000; LatestRevisionDate: 17-Jul-2002; LatestRevisionNote: Re-released for DXP Platform.; PackageReference: 0402-A; Publisher: Altium Limited; Code_JEITA: 0402
R1-R4 R113 = Res Semi: Resistor 0603; Published: 8-Jun-2000; LatestRevisionDate: 17-Jul-2002; LatestRevisionNote: Re-released for DXP Platform.; Publisher: Altium Limited
R115-R117 = Res Semi: Semiconductor Resistor; Published: 8-Jun-2000; LatestRevisionDate: 17-Jul-2002; LatestRevisionNote: Re-released for DXP Platform.; Publisher: Altium Limited
U3 = SN74AVC2T45: Dual-bit Dual-supply Bus Transceiver
U4 = DS92LV010A: Bus LVDS 3.3/5.0V Single Transceiver
U24 = Osc_Socket: 1108800 ARIES Oscillator Socket
U25 = LED_Tri: 564-0200-132F

## Sheet UserClock.SchDoc: FPGA Motherboard for Digital Multiplexed Readout, McGill U.
size Letter; DocumentNumber: DfMUX15; Revision: Rev0, Prototype; SheetNumber: 15; SheetTotal: 27; PageSetup: Record=PageOptions|CenterHorizontal=True|CenterVertical=True|PrintScale=0.93|XCorrection=1.00|YCorrection=1.00|PrintKind=0|BorderSize=5000000|LeftOffset=0|BottomOffset=0|Orientation=2|PaperLength=1000|PaperWidth=1000|Scale=100|PaperSource=7|PrintQuality=-4|MediaType=1|DitherType=10|PaperKind=Letter|PrintScaleMode=1
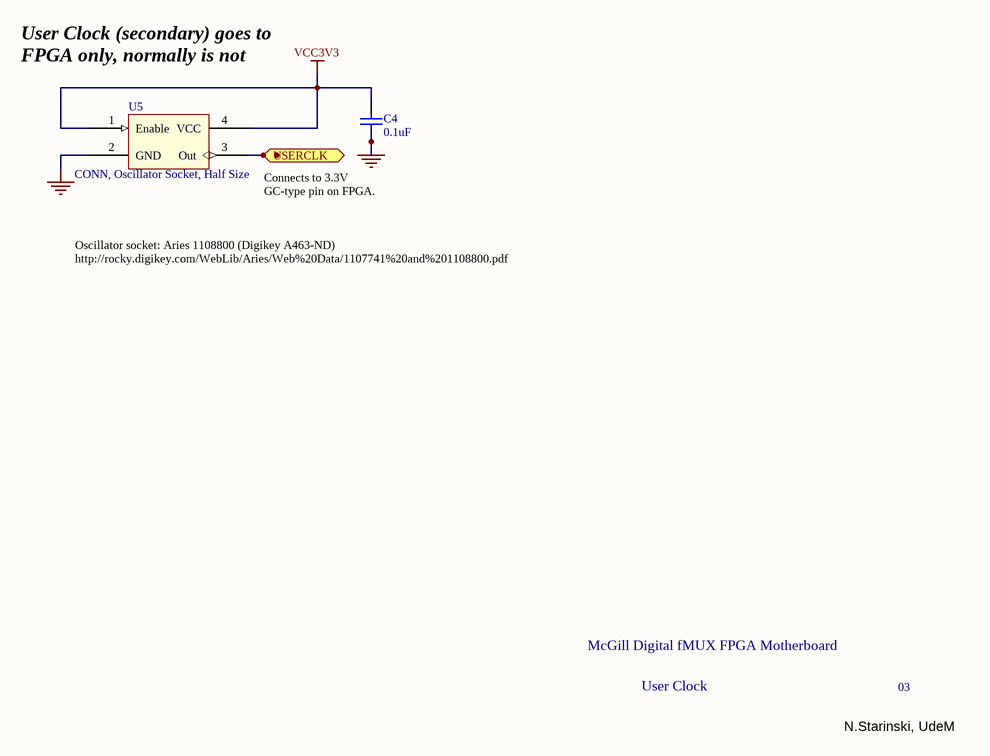
[diagram p12: UserClock.SchDoc]

### Parts
C4  0.1uF  [CC1608-0603]
U5  CONN, Oscillator Socket, Half Size  [DIP_Osc]

### Ports
USERCLK (out)

### Nets
GND: C4.1 U5.2(GND)
VCC3V3: C4.2 U5.1(Enable) U5.4(VCC)
USERCLK: U5.3(Out) ; port USERCLK

### Notes on the sheet
- User Clock (secondary) goes to
  FPGA only, normally is not used.
- Connects to 3.3V
  GC-type pin on FPGA.
- Oscillator socket: Aries 1108800 (Digikey A463-ND)
  http://rocky.digikey.com/WebLib/Aries/Web%20Data/1107741%20and%201108800.pdf
- McGill Digital fMUX FPGA Motherboard
- User Clock
- 03
- N.Starinski, UdeM

### Library data of the parts
C4 = Cap Semi: Capacitor (Semiconductor SIM Model); Published: 8-Jun-2000; LatestRevisionDate: 17-Jul-2002; LatestRevisionNote: Re-released for DXP Platform.; PackageReference: C1206; Publisher: Altium Limited
U5 = Osc_Socket: 1108800 ARIES Oscillator Socket